# EAGLE schematic SDA390V1 (EAGLE 9.6.2)
Assembly variants: 75W
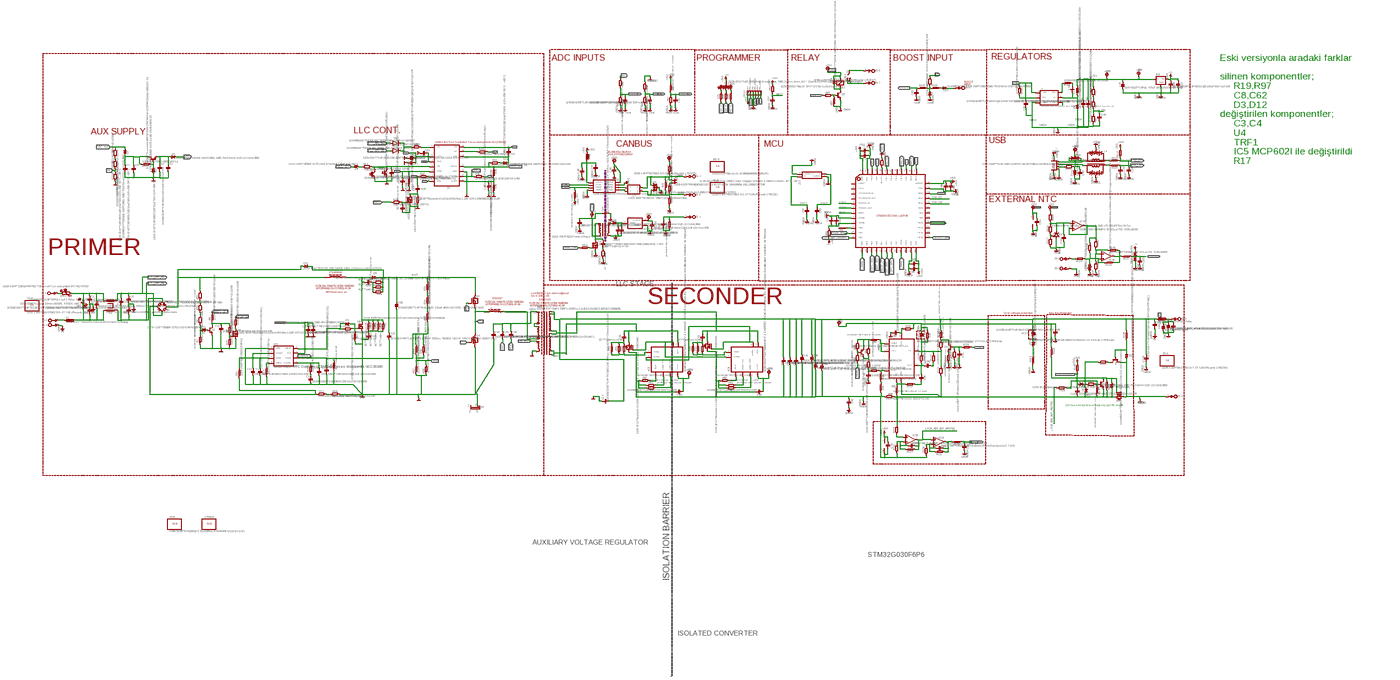
[diagram p0: schematic, sheet 1, overview]
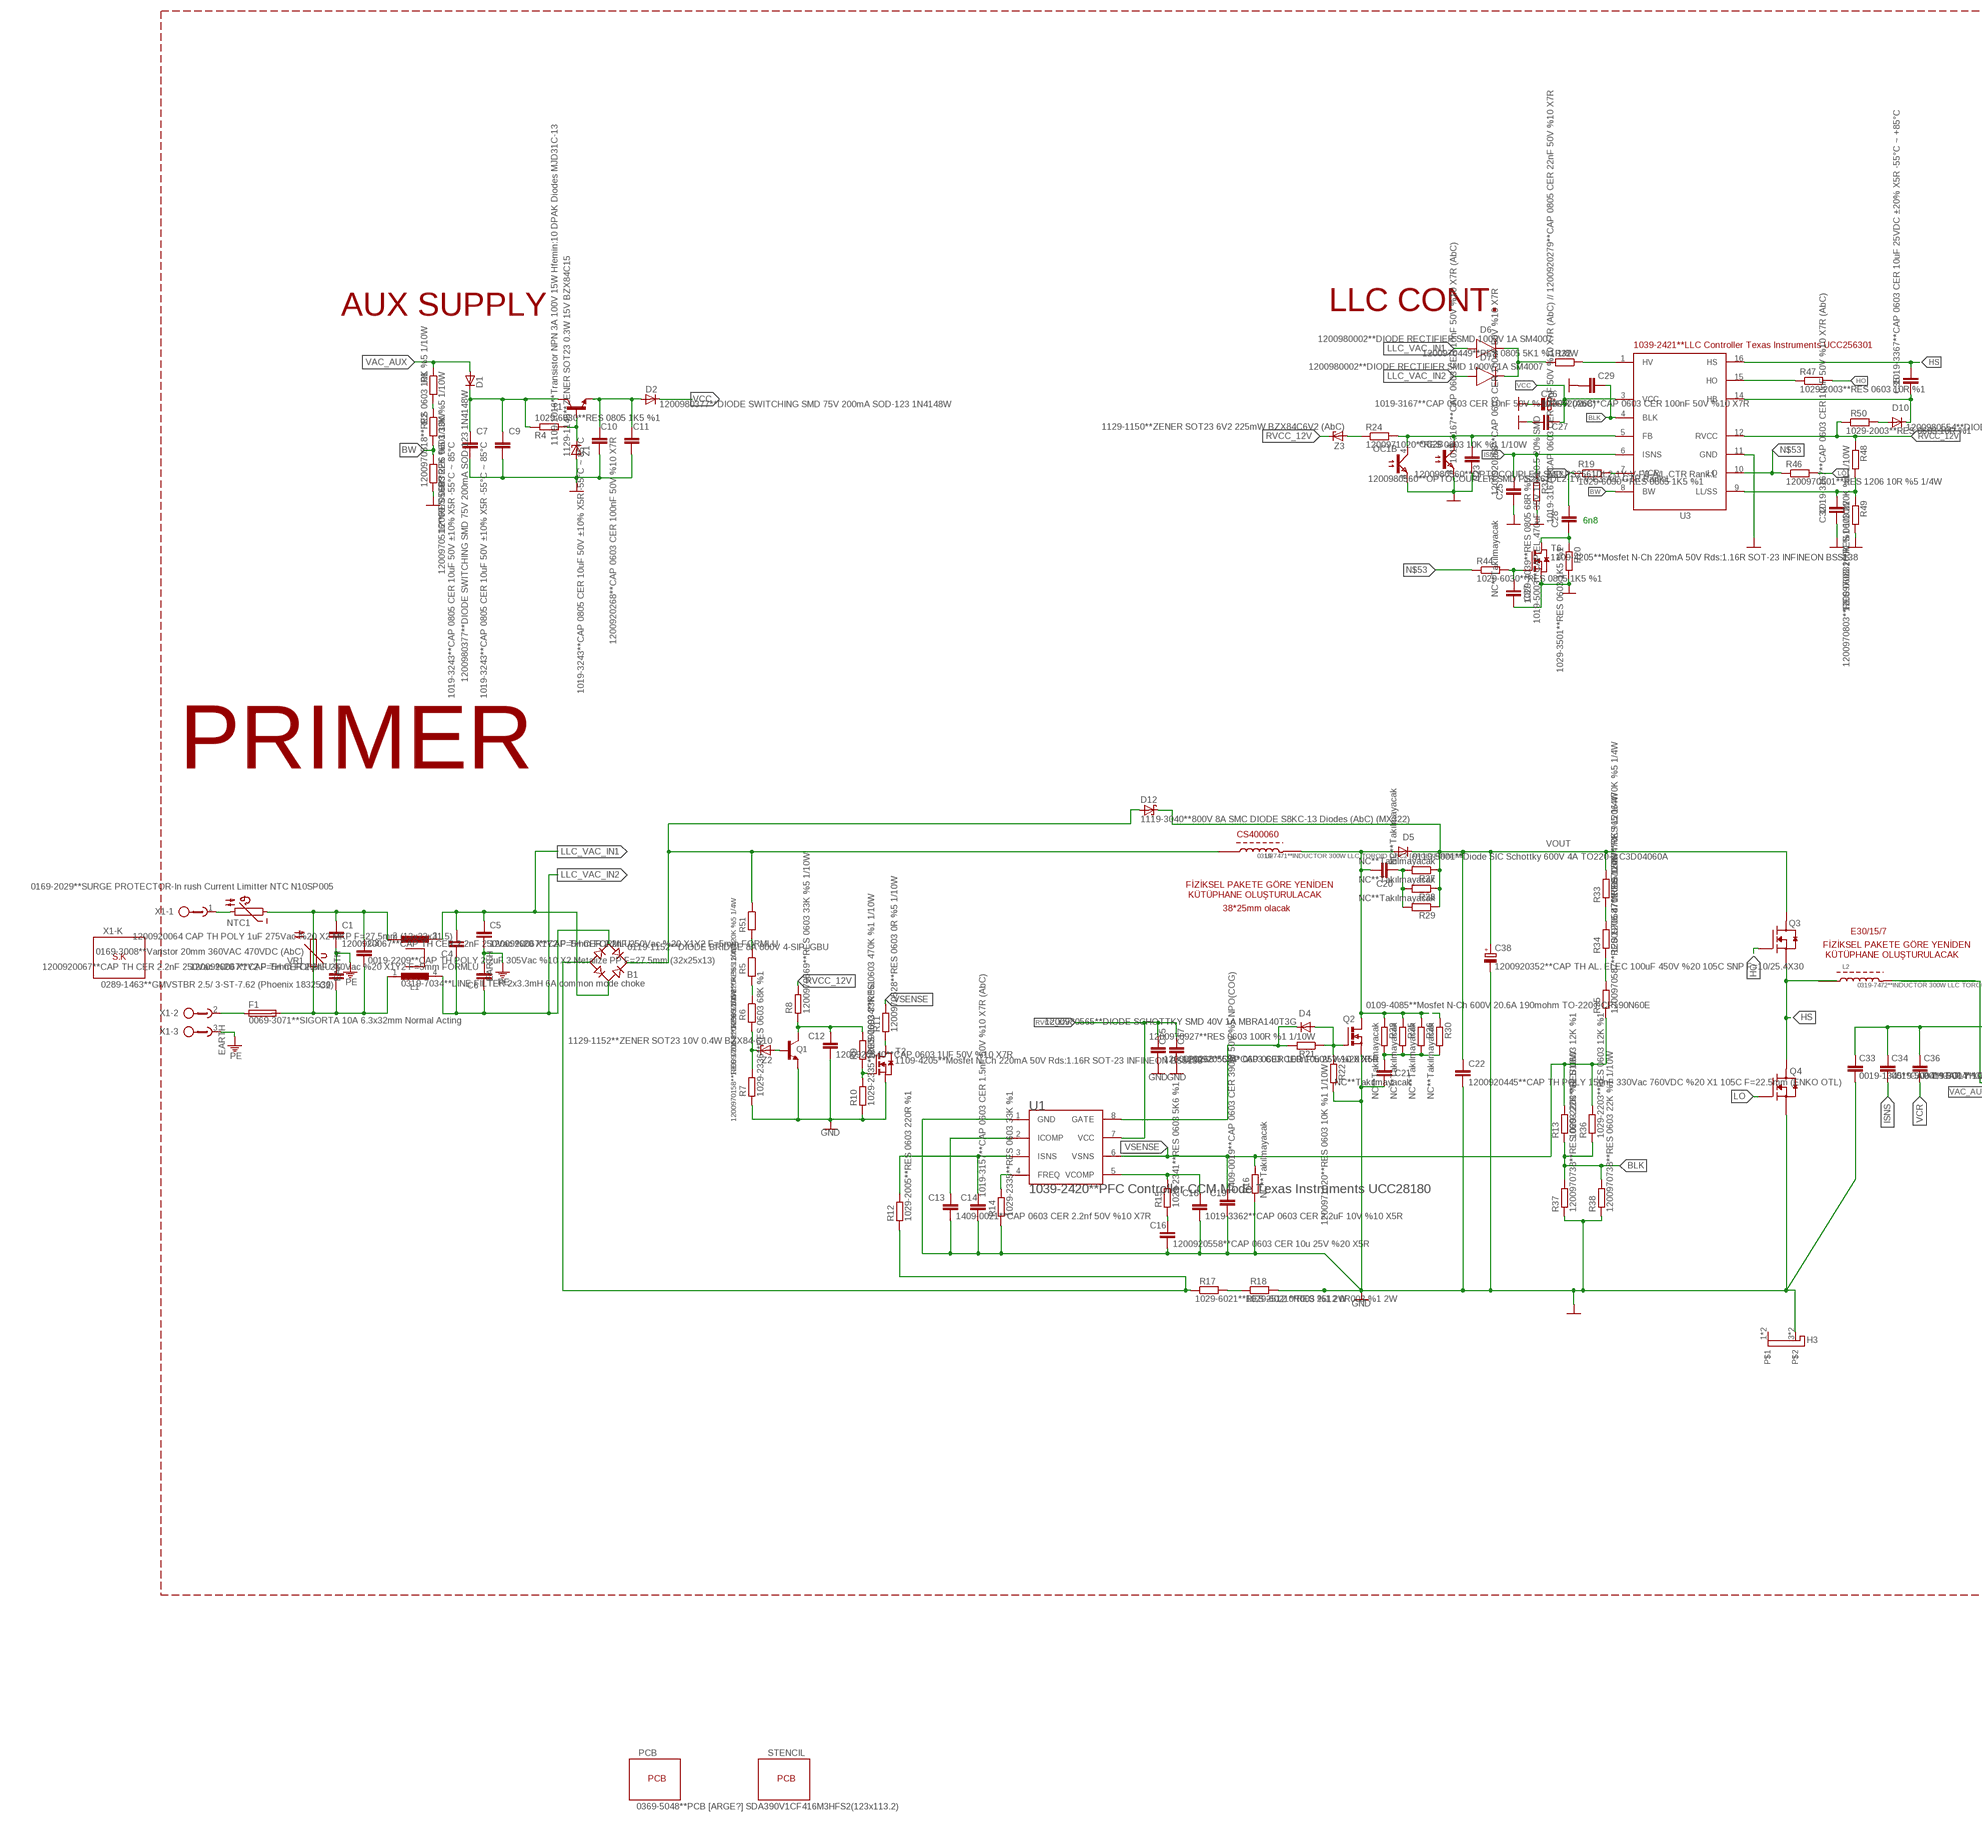
[diagram p1: schematic, sheet 1, part 1 of 6]
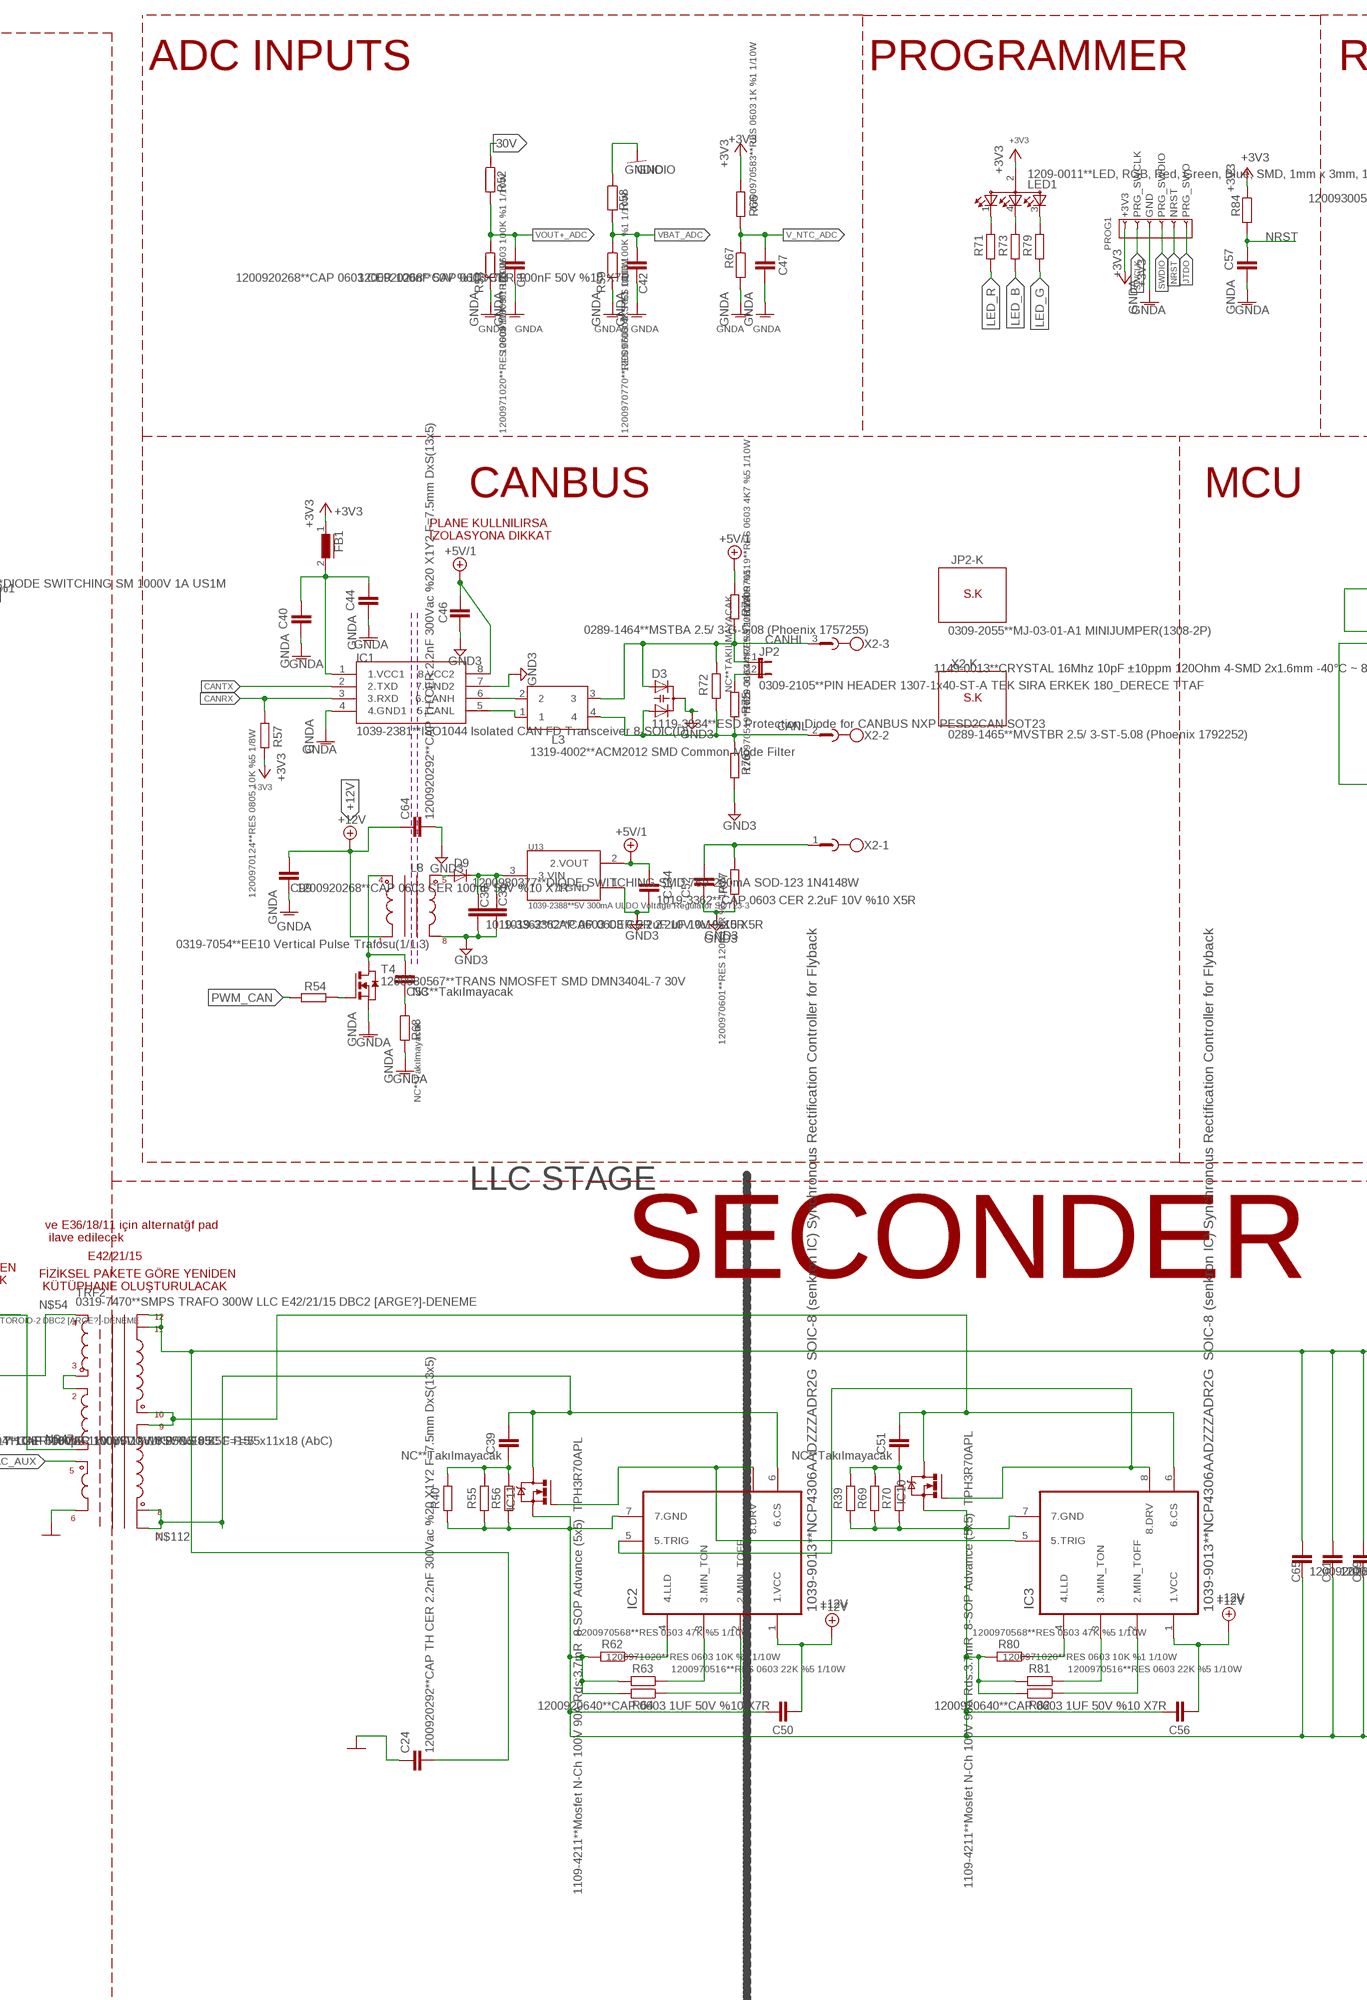
[diagram p2: schematic, sheet 1, part 2 of 6]
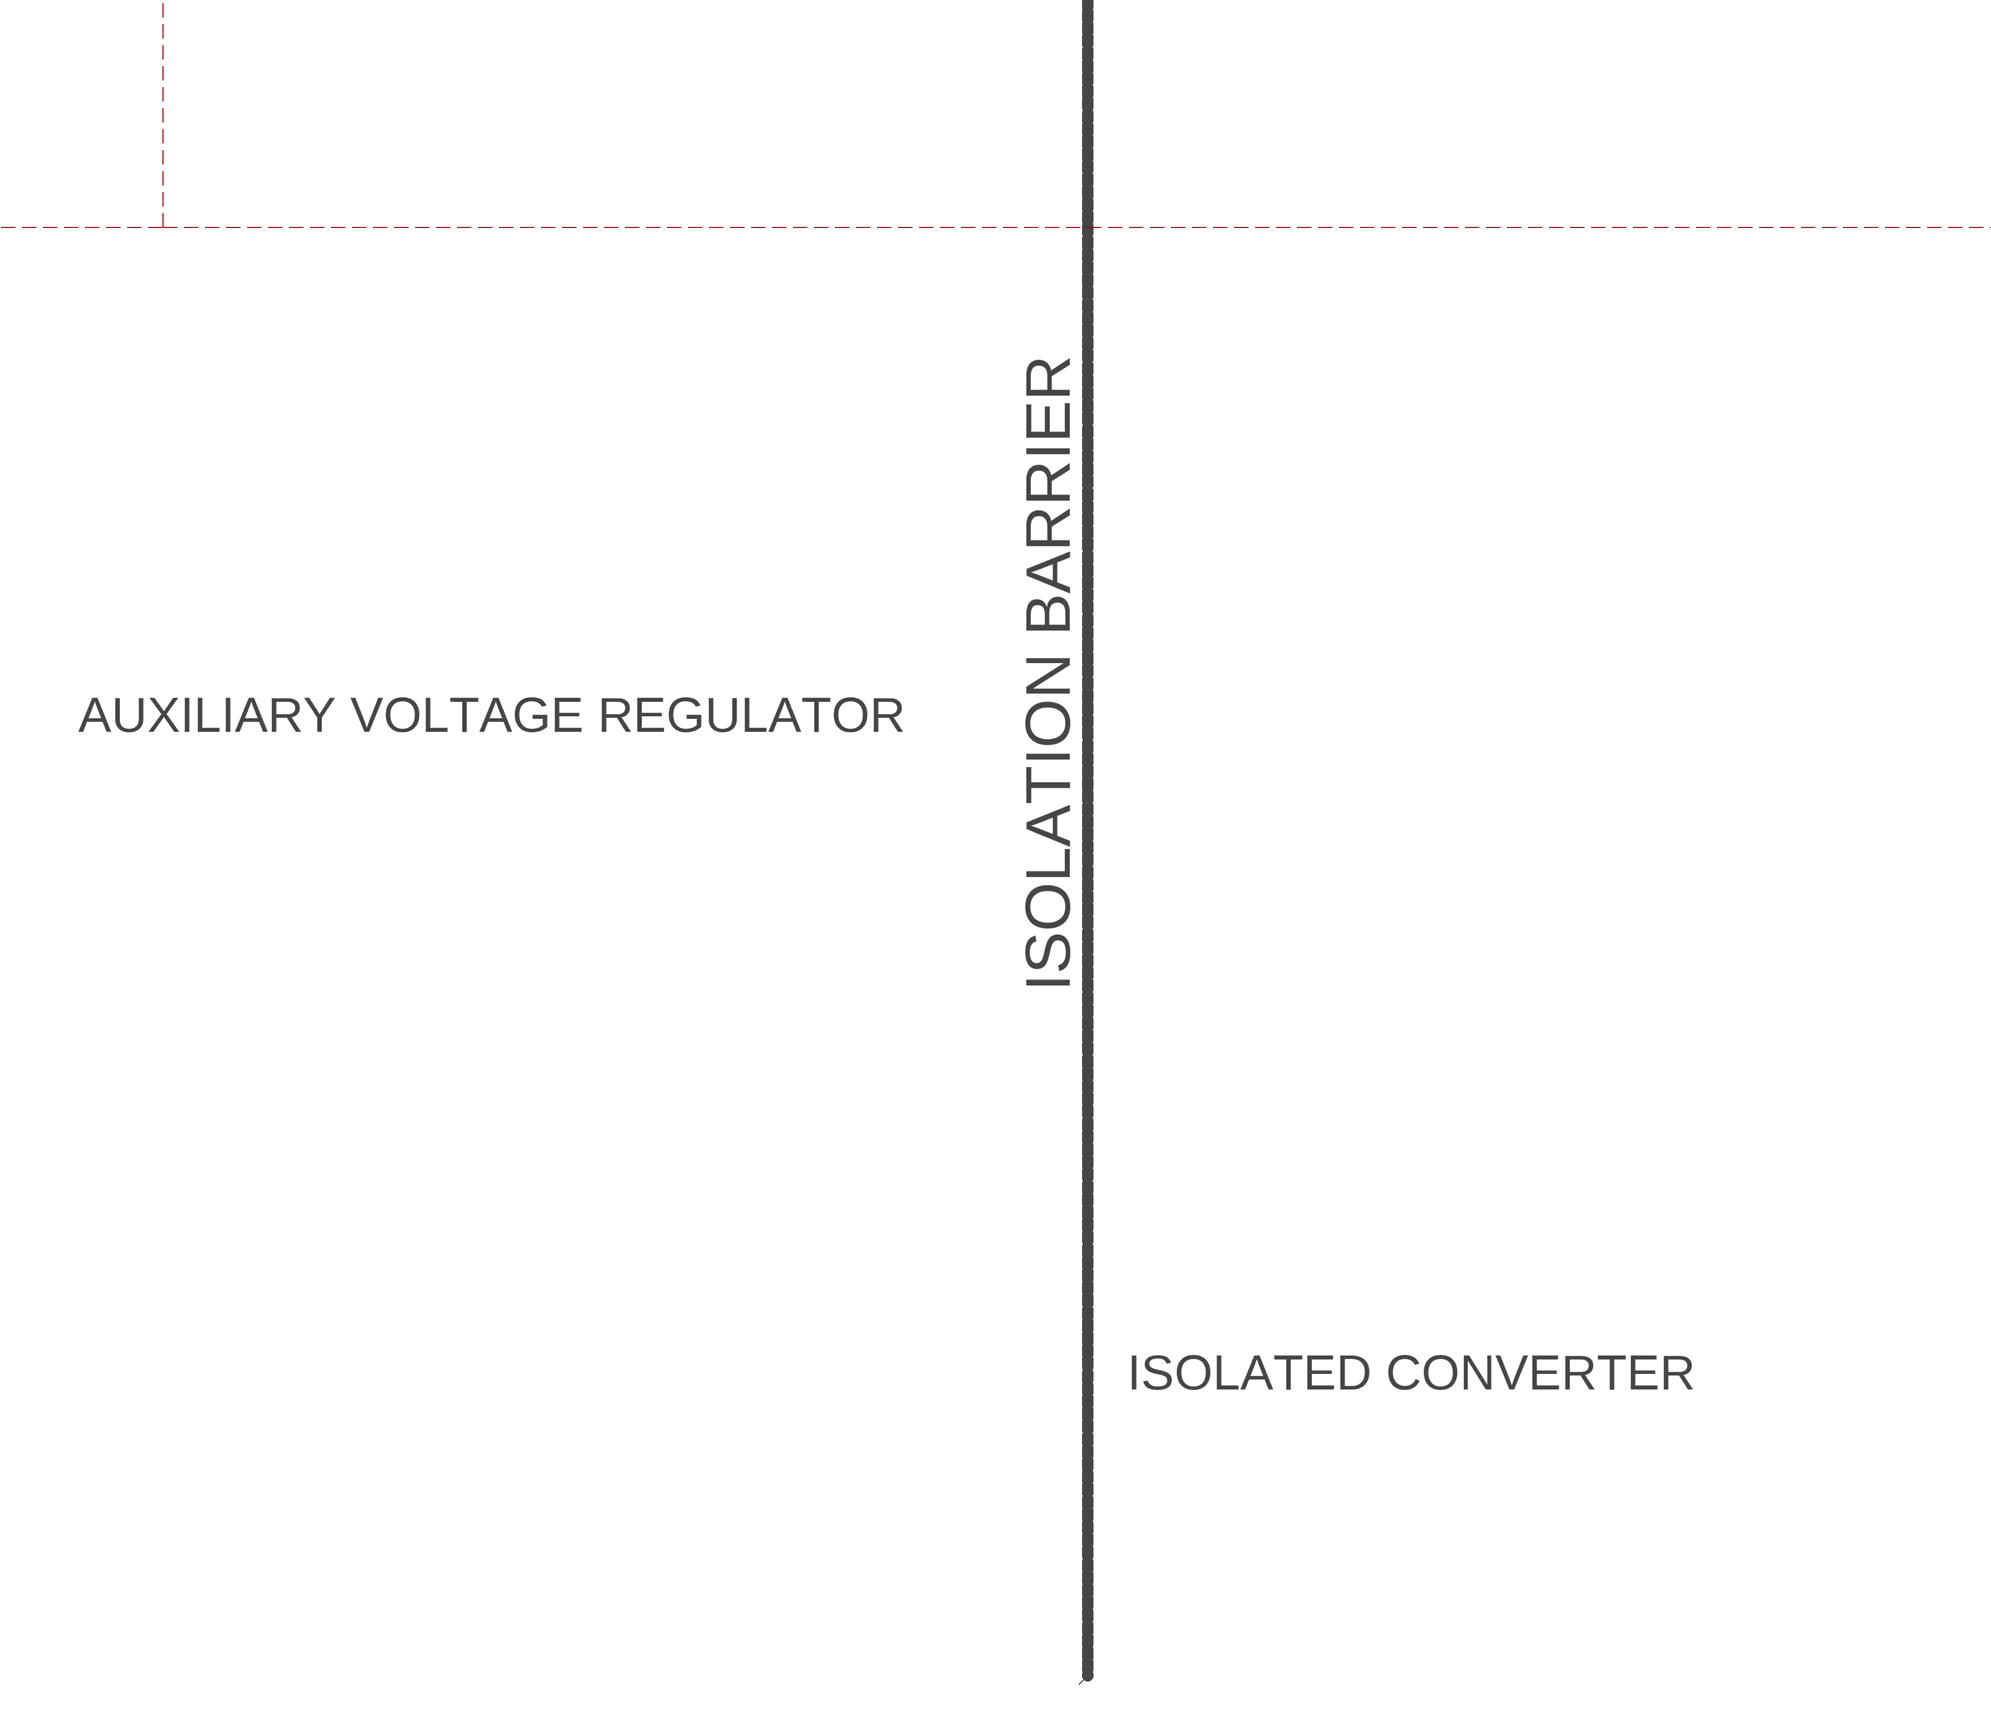
[diagram p3: schematic, sheet 1, part 3 of 6]
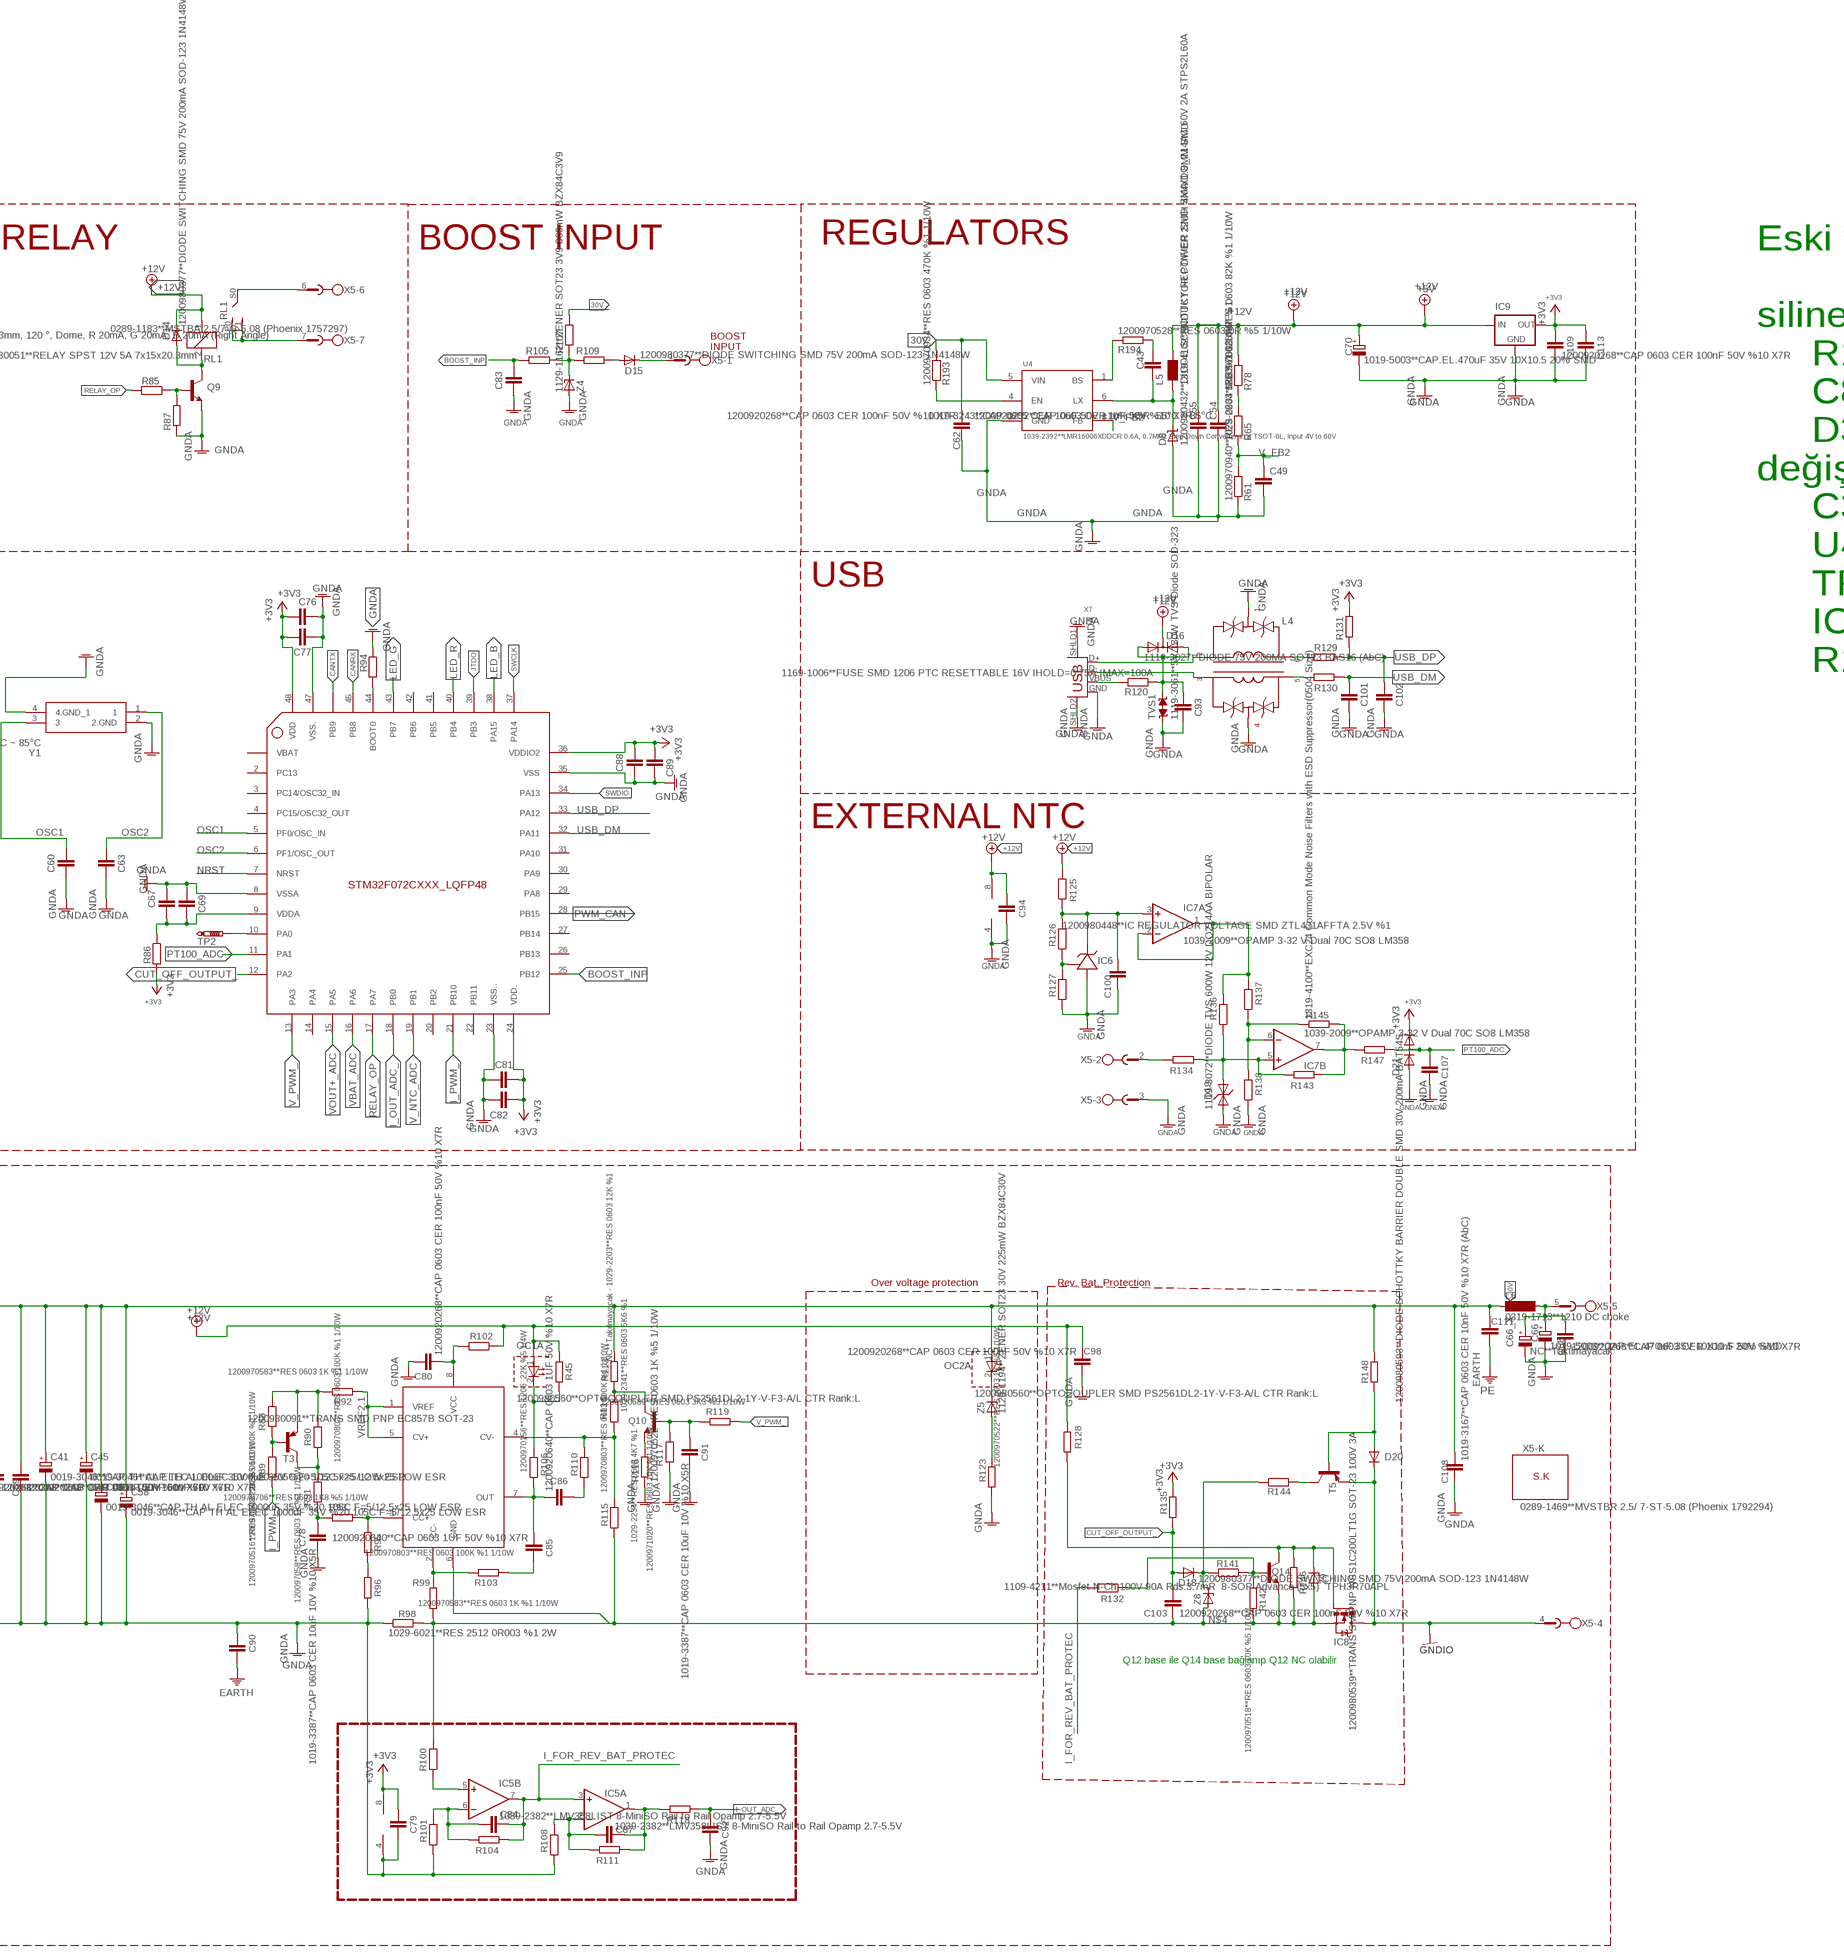
[diagram p4: schematic, sheet 1, part 4 of 6]
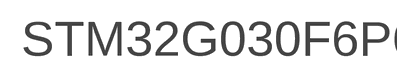
[diagram p5: schematic, sheet 1, part 5 of 6]
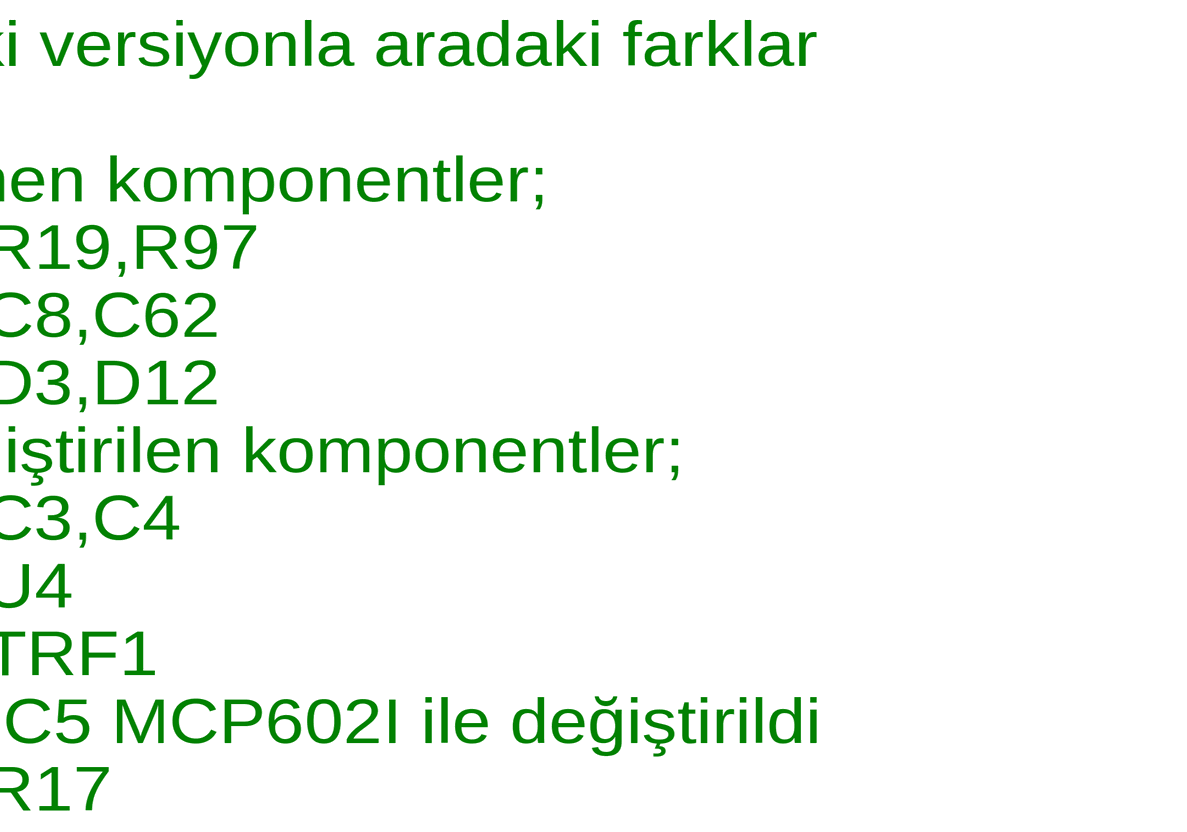
[diagram p6: schematic, sheet 1, part 6 of 6]

## Parts
B1  0119-1152**DIODE BRIDGE 8A 800V 4-SIP, GBU  DıODE_BRIDGE_8A_DIK  [DıODE_BRIDGE_8A_DIK]
C1  1200920067**CAP TH CER 2.2nF 250Vac %20 X1Y2 F=5mm FORMLU  C-EU050-035X075  [C050-035X075]
C2  1200920067**CAP TH CER 2.2nF 250Vac %20 X1Y2 F=5mm FORMLU  C-EU050-035X075  [C050-035X075]
C3  0019-2209**CAP TH POLY 2.2uF 305Vac %10 X2 Metalize PP F=27.5mm (32x25x13)  C275-134X316  [C275-134X316]
C4  1200920064 CAP TH POLY 1uF 275Vac %20 X2 MKP F=27.5mm (13x23x31.5)  C275-134X316  [C275-134X316]
C5  1200920067**CAP TH CER 2.2nF 250Vac %20 X1Y2 F=5mm FORMLU  C-EU050-035X075  [C050-035X075]
C6  1200920067**CAP TH CER 2.2nF 250Vac %20 X1Y2 F=5mm FORMLU  C-EU050-035X075  [C050-035X075]
C7  1019-3243**CAP 0805 CER 10uF 50V ±10% X5R -55°C ~ 85°C  C-EUC0805E  [C0805_ENKO]
C8  1200920268**CAP 0603 CER 100nF 50V %10 X7R  C-EUC0603E  [C0603_ENKO]
C9  1019-3243**CAP 0805 CER 10uF 50V ±10% X5R -55°C ~ 85°C  C-EUC0603E  [C0603_ENKO]
C10  1019-3243**CAP 0805 CER 10uF 50V ±10% X5R -55°C ~ 85°C  C-EUC0805E  [C0805_ENKO]
C11  1200920268**CAP 0603 CER 100nF 50V %10 X7R  C-EUC0603E  [C0603_ENKO]
C12  1200920640**CAP 0603 1UF 50V %10 X7R  C-EUC0603E  [C0603_ENKO]
C13  1409-0021**CAP 0603 CER 2.2nf 50V %10 X7R  C-EUC0603E  [C0603_ENKO]
C14  1019-3157**CAP 0603 CER 1.5nF 50V %10 X7R (AbC)  C-EUC0603E  [C0603_ENKO]
C15  1200920268**CAP 0603 CER 100nF 50V %10 X7R  C-EUC0603E  [C0603_ENKO]
C16  1200920558**CAP 0603 CER 10u 25V %20 X5R  C-EUC0603E  [C0603_ENKO]
C17  1200920558**CAP 0603 CER 10u 25V %20 X5R  C-EUC0603E  [C0603_ENKO]
C18  1019-3362**CAP 0603 CER 2.2uF 10V %10 X5R  C-EUC0603E  [C0603_ENKO]
C19  1409-0019**CAP 0603 CER 390pf 50V %5 NPO(COG)  C-EUC0603E  [C0603_ENKO]
C20  NC**Takılmayacak  C-EU050-030X075  [C050-030X075]
C21  NC**Takılmayacak  C-EU050-030X075  [C050-030X075]
C22  1200920445**CAP TH POLY 150nF 330Vac 760VDC %20 X1 105C F=22.5mm (ENKO OTL)  C-EU150-072X183  [C150-072X183]
C23  1019-3167**CAP 0603 CER 10nF 50V %10 X7R (AbC)  C-EUC0603E  [C0603_ENKO]
C24  1200920292**CAP TH CER 2.2nF 300Vac %20 X1Y2 F=7.5mm DxS(13x5)  C075-32X103_DEIF  [C075-32X103_DEIF]
C25  1200920268**CAP 0603 CER 100nF 50V %10 X7R  C-EUC0603E  [C0603_ENKO]
C26  1019-5003**CAP.EL.470uF 35V 10X10.5 20% SMD  CPOL-EUE5-10.5  [E5-10,5]
C27  1200920268**CAP 0603 CER 100nF 50V %10 X7R  C-EUC0603E  [C0603_ENKO]
C28  1019-3167**CAP 0603 CER 10nF 50V %10 X7R (AbC) // 1200920279**CAP 0805 CER 22nF 50V %10 X7R  C-EUC0603E  [C0603_ENKO]
C29  1019-3167**CAP 0603 CER 10nF 50V %10 X7R (AbC)  C-EUC0603E  [C0603_ENKO]
C30  1019-3362**CAP 0603 CER 2.2uF 10V %10 X5R  C-EUC0603E  [C0603_ENKO]
C31  1019-3362**CAP 0603 CER 2.2uF 10V %10 X5R  C-EUC0603E  [C0603_ENKO]
C32  1019-3167**CAP 0603 CER 10nF 50V %10 X7R (AbC)  C-EUC0603E  [C0603_ENKO]
C33  0019-1345**CAP TH POLY 10nF 600VAC 1000VDC MKP %5 85C F=15/5x11x18 (AbC)  C-EU150-072X183  [C150-072X183]
C34  0019-5004**CAP TH CER 100pF 1kV Y5V %10 85C F=5  C-EU050-055X075  [C050-055X075]
C35  1019-3367**CAP 0603 CER 10uF 25VDC ±20% X5R -55°C ~ +85°C  C-EUC0603E  [C0603_ENKO]
C36  0019-5004**CAP TH CER 100pF 1kV Y5V %10 85C F=5  C-EU050-050X075  [C050-050X075]
C37  NC**Takılmayacak  C-EUC0603E  [C0603_ENKO]
C38  1200920352**CAP TH AL. ELEC 100uF 450V %20 105C SNP F=10/25.4X30  CPOL-EUE10-25  [EB25D]
C39  NC**Takılmayacak  C-EUC1206E  [C1206_ENKO]
C40  1200920253**CAP 0603 CER 10n 50V%10 X7R  C-EUC0603E  [C0603_ENKO]
C41  0019-3046**CAP TH AL ELEC 1000uF 35V %20 105C F=5/12.5x25 LOW ESR  CPOL-EUE5-13  [E5-13]
C42  1200920268**CAP 0603 CER 100nF 50V %10 X7R  C-EUC0603E  [C0603_ENKO]
C43  1200920268**CAP 0603 CER 100nF 50V %10 X7R  C-EUC0603E  [C0603_ENKO]
C44  1200920268**CAP 0603 CER 100nF 50V %10 X7R  C-EUC0603E  [C0603_ENKO]
C45  0019-3046**CAP TH AL ELEC 1000uF 35V %20 105C F=5/12.5x25 LOW ESR  CPOL-EUE5-13  [E5-13]
C46  1200920268**CAP 0603 CER 100nF 50V %10 X7R  C-EUC0603E  [C0603_ENKO]
C47  1200920268**CAP 0603 CER 100nF 50V %10 X7R  C-EUC0603E  [C0603_ENKO]
C48  0019-3046**CAP TH AL ELEC 1000uF 35V %20 105C F=5/12.5x25 LOW ESR  CPOL-EUE5-13  [E5-13]
C49  1200920271**CAP 0603 CER 10pF 50V%10 COG  C-EUC0603E  [C0603_ENKO]
C50  1200920640**CAP 0603 1UF 50V %10 X7R  C-EUC0603E  [C0603_ENKO]
C51  NC**Takılmayacak  C-EUC1206E  [C1206_ENKO]
C52  1200920253**CAP 0603 CER 10n 50V%10 X7R  C-EUC0603E  [C0603_ENKO]
C53  NC**Takılmayacak  C-EUC0603E  [C0603_ENKO]
C54  1019-3243**CAP 0805 CER 10uF 50V ±10% X5R -55°C ~ 85°C  C-EUC0805E  [C0805_ENKO]
C55  1200920252**CAP 0603 CER 1nF 50V %10 X7R  C-EUC0603E  [C0603_ENKO]
C56  1200920640**CAP 0603 1UF 50V %10 X7R  C-EUC0603E  [C0603_ENKO]
C57  1200920268**CAP 0603 CER 100nF 50V %10 X7R  C-EUC0603E  [C0603_ENKO]
C58  0019-3046**CAP TH AL ELEC 1000uF 35V %20 105C F=5/12.5x25 LOW ESR  CPOL-EUE5-13  [E5-13]
C59  1200920268**CAP 0603 CER 100nF 50V %10 X7R  C-EUC0603E  [C0603_ENKO]
C60  1019-3352**CAP 0603 CER 22pF 50V %5 NPO  C-EUC0603E  [C0603_ENKO]
C61  1200920268**CAP 0603 CER 100nF 50V %10 X7R  C-EUC0603E  [C0603_ENKO]
C62  1200920268**CAP 0603 CER 100nF 50V %10 X7R  C-EUC0603E  [C0603_ENKO]
C63  1019-3352**CAP 0603 CER 22pF 50V %5 NPO  C-EUC0603E  [C0603_ENKO]
C64  1200920292**CAP TH CER 2.2nF 300Vac %20 X1Y2 F=7.5mm DxS(13x5)  C075-32X103_DEIF  [C075-32X103_DEIF]
C65  1200920268**CAP 0603 CER 100nF 50V %10 X7R  C-EUC0603E  [C0603_ENKO]
C66  1019-5003**CAP.EL.470uF 35V 10X10.5 20% SMD  CPOL-EUE5-10.5  [E5-10,5]
C66_X  NC**Takılmayacak  CPOL-EUE2.5-7  [E2,5-7]
C67  1200920268**CAP 0603 CER 100nF 50V %10 X7R  C-EUC0603E  [C0603_ENKO]
C68  1200920268**CAP 0603 CER 100nF 50V %10 X7R  C-EUC0603E  [C0603_ENKO]
C69  1019-3167**CAP 0603 CER 10nF 50V %10 X7R (AbC)  C-EUC0603E  [C0603_ENKO]
C70  1019-5003**CAP.EL.470uF 35V 10X10.5 20% SMD  CPOL-EUE5-10.5  [E5-10,5]
C76  1200920268**CAP 0603 CER 100nF 50V %10 X7R  C-EUC0603E  [C0603_ENKO]
C77  1019-3167**CAP 0603 CER 10nF 50V %10 X7R (AbC)  C-EUC0603E  [C0603_ENKO]
C78  1019-3387**CAP 0603 CER 10uF 10V %10 X5R  C-EUC0603E  [C0603_ENKO]
C79  1200920268**CAP 0603 CER 100nF 50V %10 X7R  C-EUC0603E  [C0603_ENKO]
C80  1200920268**CAP 0603 CER 100nF 50V %10 X7R  C-EUC0603E  [C0603_ENKO]
C81  1019-3167**CAP 0603 CER 10nF 50V %10 X7R (AbC)  C-EUC0603E  [C0603_ENKO]
C82  1200920268**CAP 0603 CER 100nF 50V %10 X7R  C-EUC0603E  [C0603_ENKO]
C83  1019-3167**CAP 0603 CER 10nF 50V %10 X7R (AbC)  C-EUC0603E  [C0603_ENKO]
C84  NC**TAKILMAYACAK (Not Fitted)  C-EUC0603E  [C0603_ENKO]
C85  1200920640**CAP 0603 1UF 50V %10 X7R  C-EUC0603E  [C0603_ENKO]
C86  1200920640**CAP 0603 1UF 50V %10 X7R  C-EUC0603E  [C0603_ENKO]
C87  1200920371**CAP 0603 CER 150p 50V%5 COG  C-EUC0603E  [C0603_ENKO]
C88  1019-3167**CAP 0603 CER 10nF 50V %10 X7R (AbC)  C-EUC0603E  [C0603_ENKO]
C89  1200920268**CAP 0603 CER 100nF 50V %10 X7R  C-EUC0603E  [C0603_ENKO]
C90  NC**TAKILMAYACAK (Not Fitted)  C-EU050-035X075  [C050-035X075]
C91  1019-3387**CAP 0603 CER 10uF 10V %10 X5R  C-EUC0603E  [C0603_ENKO]
C92  1200920268**CAP 0603 CER 100nF 50V %10 X7R  C-EUC0603E  [C0603_ENKO]
C93  1200920268**CAP 0603 CER 100nF 50V %10 X7R  C-EUC0603E  [C0603_ENKO]
C94  1200920268**CAP 0603 CER 100nF 50V %10 X7R  C-EUC0603E  [C0603_ENKO]
C98  1200920268**CAP 0603 CER 100nF 50V %10 X7R  C-EUC0603E  [C0603_ENKO]
C99  1200920268**CAP 0603 CER 100nF 50V %10 X7R  C-EUC0603E  [C0603_ENKO]
C100  1200920268**CAP 0603 CER 100nF 50V %10 X7R  C-EUC0603E  [C0603_ENKO]
C101  1019-3381**CAP 0603 CER 33pf 50V %5 NPO(COG)  C-EUC0603E  [C0603_ENKO]
C102  1019-3381**CAP 0603 CER 33pf 50V %5 NPO(COG)  C-EUC0603E  [C0603_ENKO]
C103  1200920268**CAP 0603 CER 100nF 50V %10 X7R  C-EUC0603E  [C0603_ENKO]
C107  1200920268**CAP 0603 CER 100nF 50V %10 X7R  C-EUC0603E  [C0603_ENKO]
C108  1019-3167**CAP 0603 CER 10nF 50V %10 X7R (AbC)  C-EUC0603E  [C0603_ENKO]
C109  1200920268**CAP 0603 CER 100nF 50V %10 X7R  C-EUC0603E  [C0603_ENKO]
C111  0019-1391**CAP TH CER 4700pF 250VAC 2.5kVDC X1Y2 %20 85C F=5mm  C-EU050-035X075  [C050-035X075]
C113  1019-3375**CAP 0603 CER 22uF 10V %20 X5R  C-EUC0603E  [C0603_ENKO]
C134  1019-3362**CAP 0603 CER 2.2uF 10V %10 X5R  C-EUC0603E  [C0603_ENKO]
D1  1200980377**DIODE SWITCHING SMD 75V 200mA SOD-123 1N4148W  DIODE-SOD123  [SOD123]
D2  1200980377**DIODE SWITCHING SMD 75V 200mA SOD-123 1N4148W  DIODE-SOD123  [SOD123]
D3  1119-3034**ESD Protection Diode for CANBUS NXP PESD2CAN SOT23  DIODE-2CAPACITANCESOT23  [SOT23]
D4  1200980565**DIODE SCHOTTKY SMD 40V 1A MBRA140T3G  DIODE-SOD106-R  [SOD106-R]
D5  0119-5001**Diode SIC Schottky 600V 4A TO220-2 C3D04060A  DIODE_12A_1000V_TO220  [DIODE_12A_1000V_TO220]
D6  1200980002**DIODE RECTIFIER SMD 1000V 1A SM4007  DIODE_DO-213AB(5025-METRIC)  [DIOMELF5024]
D7  1200980002**DIODE RECTIFIER SMD 1000V 1A SM4007  DIODE_DO-213AB(5025-METRIC)  [DIOMELF5024]
D8  1200980432**DIODE SCHOTTKY RECTIFIER SMD SMA/DO_214AC 60V 2A STPS2L60A  SD-SMA  [SMA]
D9  1200980377**DIODE SWITCHING SMD 75V 200mA SOD-123 1N4148W  DIODE-SOD123  [SOD123]
D10  1200980554**DIODE SWITCHING SM 1000V 1A US1M  DIODE-SOD106-R  [SOD106-R]
D12  1119-3040**800V 8A SMC DIODE S8KC-13 Diodes (AbC) (MX322)  SCHOTTKY-DIODESMC  [SMC]
D14  1200980377**DIODE SWITCHING SMD 75V 200mA SOD-123 1N4148W  DIODE-SOD123  [SOD123]
D15  1200980377**DIODE SWITCHING SMD 75V 200mA SOD-123 1N4148W  DIODE-SOD123  [SOD123]
D16  1119-3027**DIODE 75V 200MA SOT23 BAS16 (AbC)  DIODE-2AC|CASOT23  [SOT23]
D18  1200980377**DIODE SWITCHING SMD 75V 200mA SOD-123 1N4148W  DIODE-SOD123  [SOD123]
D19  1119-3072**DIODE TVS 600W 12V DO214AA BIPOLAR  TRANSIL_SMB  [TRANSIL_SMB]
D20  1200980377**DIODE SWITCHING SMD 75V 200mA SOD-123 1N4148W  DIODE-SOD123  [SOD123]
D21  1200980593**DIODE SCHOTTKY BARRIER DOUBLE SMD 30V 200mA BAT54S  BAV199  [SOT23]
F1  0069-3071**SIGORTA 10A 6.3x32mm Normal Acting  19560  [19560]
FB1  1319-4060**Ferrite Bead SMD 0805 2kOhm@100MHz 300mA LAIRD HZ0805C202R-10  FERRITE_BEAT_0805  [FERRITE_BEAT_0805]
H3  DEIF_SOGUTUCU_300W  [DEIF_SOGUTUCU_300W]
IC1  1039-2381**ISO1044 Isolated CAN FD Transceiver 8-SOIC(D)  ISO1044  [ISO1044]
IC2  1039-9013**NCP4306AADZZZADR2G SOIC-8 (senkron IC) Synchronous Rectification Controller for Flyback  NCP4306  [NCP4306]
IC3  1039-9013**NCP4306AADZZZADR2G SOIC-8 (senkron IC) Synchronous Rectification Controller for Flyback  NCP4306  [NCP4306]
IC4  1039-2224**TSM1011ID SO-8 Constant Voltage and Constant Current Controller  TSM1011  [SO-8]
IC5  1039-2382**LMV358LIST 8-MiniSO Rail to Rail Opamp 2.7-5.5V  LMV358M  [SO08]
IC6  1200980448**IC REGULATOR VOLTAGE SMD ZTL431AFFTA 2.5V %1  TL431_SOT23F  [TL431_SOT23F]
IC7  1039-2009**OPAMP 3-32 V Dual 70C SO8 LM358  LM358D  [SO08]
IC8  1109-4211**Mosfet N-Ch 100V 90A Rds:3.7mR 8-SOP Advance (5x5) TPH3R70APL  TPH6R30ANL  [TPH6R30ANL]
IC9  1039-3003**Voltage Regulator SOT-89 3.3V Diodes AP2204RA-3.3TRG1  S-812XSGUP  [SOT89]
IC10  1109-4211**Mosfet N-Ch 100V 90A Rds:3.7mR 8-SOP Advance (5x5) TPH3R70APL  TPH6R30ANL  [TPH6R30ANL]
IC11  1109-4211**Mosfet N-Ch 100V 90A Rds:3.7mR 8-SOP Advance (5x5) TPH3R70APL  TPH6R30ANL  [TPH6R30ANL]
JP2  0309-2105**PIN HEADER 1307-1x40-ST-A TEK SIRA ERKEK 180_DERECE TTAF  JP1E  [JP1]
JP2-K  0309-2055**MJ-03-01-A1 MINIJUMPER(1308-2P)  SOKET  [SOKET]
L1  0319-7034**LINE FILTER 2x3.3mH 6A common mode choke  EPCOS_B82724J  [EPCOS_B82724J]
L2  0319-7472**INDUCTOR 300W LLC TOROID-2 DBC2 [ARGE?]-DENEME  E25/13/7  [E25/13/7]
L3  1319-4002**ACM2012 SMD Common Mode Filter  ACM2012-900--2P-T002  [ACM2012-900--2P-T002]
L4  1319-4100**EXC24 Common Mode Noise Filters with ESD Suppressor(0504 Size)  EXC24CS_COMMON_MODE  [EXC24CS_COMMON_MODE]
L5  1319-4102**INDUCTOR POWER 22UH 4X4X1.8MM SMD  WE-PD2WE_PD2_5MM  [WE-PD2_5MM]
L6  0319-1713**1210 DC choke  INDUCTOR-NEOSID  [INDUCTOR-NEOSID]
L8  0319-7054**EE10 Vertical Pulse Trafosu(1/1.3)  EE10_V_4+4  [EE10_V_4+4]
LED1  1209-0011**LED, RGB, Red, Green, Blue, SMD, 1mm x 3mm, 120 °, Dome, R 20mA, G 20mA, B 20mA (Right Angle)  KPFA-3010RGBC-11  [KPFA-3010RGBC-11]
NTC1  0169-2029**SURGE PROTECTOR-In rush Current Limitter NTC N10SP005  SENS_NTC  [SENS_NTC]
OC1  1200980560**OPTOCOUPLER SMD PS2561DL2-1Y-V-F3-A/L CTR Rank:L  PS2561DL2-1_OPTO1  [PS2561DL2-1_OPTO1]
OC2  1200980560**OPTOCOUPLER SMD PS2561DL2-1Y-V-F3-A/L CTR Rank:L  PS2561DL2-1_OPTO1  [PS2561DL2-1_OPTO1]
PCB  0369-5048**PCB [ARGE?] SDA390V1CF416M3HFS2(123x113.2)  PCB  [PCB]
PROG1  NC**TAKILMAYACAK  PROG_6PIN  [PROG_6PIN]
Q1  1200980090**TRANS SMD NPN BC847B SOT-23  BC846ALT1SMD  [SOT23]
Q2  0109-4085**Mosfet N-Ch 600V 20.6A 190mohm TO-220 FCP190N60E  PMOSFET_NTO220BV  [TO220BV]
Q3  0109-4088**Mosfet N-Ch 10.2A 650V Rds:380mR TO-220F Fairchild FCPF380N65FL1  ISO_TO_220  [ISO_TO_220]
Q4  0109-4088**Mosfet N-Ch 10.2A 650V Rds:380mR TO-220F Fairchild FCPF380N65FL1  ISO_TO_220  [ISO_TO_220]
Q9  1200980090**TRANS SMD NPN BC847B SOT-23  BC846ALT1SMD  [SOT23]
Q10  1200980090**TRANS SMD NPN BC847B SOT-23  BC846BLT1SMD  [SOT23]
Q14  1200980090**TRANS SMD NPN BC847B SOT-23  BC846ALT1SMD  [SOT23]
R1  1200970569**RES 0603 33K %5 1/10W  R-EU_R0603E  [R0603_ENKO]
R2  1200970516**RES 0603 22K %5 1/10W  R-EU_R0603E  [R0603_ENKO]
R3  1200970518**RES 0603 10K %5 1/10W  R-EU_R0603E  [R0603_ENKO]
R4  1029-6030**RES 0805 1K5 %1  R-EU_R0805E  [R0805_ENKO]
R5  1200970158**RES 1206 220K %5 1/4W  R-EU_R1206  [R1206]
R6  1200970158**RES 1206 220K %5 1/4W  R-EU_R1206  [R1206]
R7  1029-2336**RES 0603 68K %1  R-EU_R0603E  [R0603_ENKO]
R8  1200970569**RES 0603 33K %5 1/10W  R-EU_R0603E  [R0603_ENKO]
R9  1200970934**RES 0603 470K %1 1/10W  R-EU_R0603E  [R0603_ENKO]
R10  1029-2335**RES 0603 33K %1  R-EU_R0603E  [R0603_ENKO]
R11  1200970528**RES 0603 0R %5 1/10W  R-EU_R0603E  [R0603_ENKO]
R12  1029-2005**RES 0603 220R %1  R-EU_R0603E  [R0603_ENKO]
R13  1029-2203**RES 0603 12K %1  R-EU_R0603E  [R0603_ENKO]
R14  1029-2335**RES 0603 33K %1  R-EU_R0603E  [R0603_ENKO]
R15  1029-2341**RES 0603 5K6 %1  R-EU_R0603E  [R0603_ENKO]
R16  NC**Takılmayacak  R-EU_R0603E  [R0603_ENKO]
R17  1029-6021**RES 2512 0R003 %1 2W  R-EU_R2512  [R2512]
R18  1029-6021**RES 2512 0R003 %1 2W  R-EU_R2512  [R2512]
R19  1029-6030**RES 0805 1K5 %1  R-EU_R0805E  [R0805_ENKO]
R20  1029-3501**RES 0603 1K5 %1  R-EU_R0603E  [R0603_ENKO]
R21  1200970927**RES 0603 100R %1 1/10W  R-EU_R0603E  [R0603_ENKO]
R22  1200971020**RES 0603 10K %1 1/10W  R-EU_R0603E  [R0603_ENKO]
R23  NC**Takılmayacak  R-EU_R1206E  [R1206_ENKO]
R24  1200971020**RES 0603 10K %1 1/10W  R-EU_R0603E  [R0603_ENKO]
R25  NC**Takılmayacak  R-EU_R1206E  [R1206_ENKO]
R26  NC**Takılmayacak  R-EU_R1206E  [R1206_ENKO]
R27  NC**Takılmayacak  R-EU_R1206E  [R1206_ENKO]
R28  NC**Takılmayacak  R-EU_R1206E  [R1206_ENKO]
R29  NC**Takılmayacak  R-EU_R1206E  [R1206_ENKO]
R30  NC**Takılmayacak  R-EU_R1206E  [R1206_ENKO]
R31  1029-3039**RES 0805 68R %5  R-EU_R0603E  [R0603_ENKO]
R32  1200970449**RES 0805 5K1 %1 1/8W  R-EU_R0805E  [R0805_ENKO]
R33  1200970587**RES 1206 470K %5 1/4W  R-EU_R1206E  [R1206_ENKO]
R34  1200970587**RES 1206 470K %5 1/4W  R-EU_R1206E  [R1206_ENKO]
R35  1200970587**RES 1206 470K %5 1/4W  R-EU_R1206E  [R1206_ENKO]
R36  1029-2203**RES 0603 12K %1  R-EU_R0603E  [R0603_ENKO]
R37  1200970738**RES 0603 22K %1 1/10W  R-EU_R0603E  [R0603_ENKO]
R38  1200970738**RES 0603 22K %1 1/10W  R-EU_R0603E  [R0603_ENKO]
R39  NC**TAKILMAYACAK  R-EU_R1206E  [R1206_ENKO]
R40  NC**TAKILMAYACAK  R-EU_R1206E  [R1206_ENKO]
R44  1029-6030**RES 0805 1K5 %1  R-EU_R0805E  [R0805_ENKO]
R45  1409-0025**RES 0603 470R %5 1/16W  R-EU_R0603E  [R0603_ENKO]
R46  1200970601**RES 1206 10R %5 1/4W  R-EU_R1206E  [R1206_ENKO]
R47  1029-2003**RES 0603 10R %1  R-EU_R0603E  [R0603_ENKO]
R48  1200970832**RES 0603 220K %1 1/10W  R-EU_R0603E  [R0603_ENKO]
R49  1200970803**RES 0603 100K %1 1/10W  R-EU_R0603E  [R0603_ENKO]
R50  1029-2003**RES 0603 10R %1  R-EU_R0603E  [R0603_ENKO]
R51  1200970158**RES 1206 220K %5 1/4W  R-EU_R1206  [R1206]
R52  1200970803**RES 0603 100K %1 1/10W  R-EU_R0603E  [R0603_ENKO]
R53  1200971020**RES 0603 10K %1 1/10W  R-EU_R0603E  [R0603_ENKO]
R54  1029-2003**RES 0603 10R %1  R-EU_R0603E  [R0603_ENKO]
R55  NC**TAKILMAYACAK  R-EU_R1206E  [R1206_ENKO]
R56  NC**Takılmayacak  R-EU_R1206E  [R1206_ENKO]
R57  1200970124**RES 0805 10K %5 1/8W  R-EU_R0805E  [R0805_ENKO]
R58  1200970803**RES 0603 100K %1 1/10W  R-EU_R0603E  [R0603_ENKO]
R59  1200970770**RES 0603 4K3 %1 1/10W  R-EU_R0603E  [R0603_ENKO]
R61  1200970940**RES 0603 6K8 %1 1/10W  R-EU_R0603E  [R0603_ENKO]
R62  1200970568**RES 0603 47K %5 1/10W  R-EU_R0603E  [R0603_ENKO]
R63  1200971020**RES 0603 10K %1 1/10W  R-EU_R0603E  [R0603_ENKO]
R64  1200970516**RES 0603 22K %5 1/10W  R-EU_R0603E  [R0603_ENKO]
R65  1029-2234**RES 0603 4K7 %1  R-EU_R0603E  [R0603_ENKO]
R66  1200970583**RES 0603 1K %1 1/10W  R-EU_R0603E  [R0603_ENKO]
R67  1169-1001**TSM2A103F3951RZ THINKING 0805 10K NTC 125C  R-EU_R0805E  [R0805_ENKO]
R68  NC**Takılmayacak  R-EU_R0603E  [R0603_ENKO]
R69  NC**TAKILMAYACAK  R-EU_R1206E  [R1206_ENKO]
R70  NC**Takılmayacak  R-EU_R1206E  [R1206_ENKO]
R71  1029-2005**RES 0603 220R %1  R-EU_R0603E  [R0603_ENKO]
R72  NC**TAKILMAYACAK  R-EU_R1206E  [R1206_ENKO]
R73  1029-2005**RES 0603 220R %1  R-EU_R0603E  [R0603_ENKO]
R74  1200970519**RES 0603 4K7 %5 1/10W  R-EU_R0603E  [R0603_ENKO]
R75  1029-3164**RES 1206 120R %1  R-EU_R1206E  [R1206_ENKO]
R76  1200970519**RES 0603 4K7 %5 1/10W  R-EU_R0603E  [R0603_ENKO]
R77  1200970601**RES 1206 10R %5 1/4W  R-EU_R1206E  [R1206_ENKO]
R78  1200970626**RES 0603 82K %1 1/10W  R-EU_R0603E  [R0603_ENKO]
R79  1029-2005**RES 0603 220R %1  R-EU_R0603E  [R0603_ENKO]
R80  1200970568**RES 0603 47K %5 1/10W  R-EU_R0603E  [R0603_ENKO]
R81  1200971020**RES 0603 10K %1 1/10W  R-EU_R0603E  [R0603_ENKO]
R82  1200970516**RES 0603 22K %5 1/10W  R-EU_R0603E  [R0603_ENKO]
R84  1200970518**RES 0603 10K %5 1/10W  R-EU_R0603E  [R0603_ENKO]
R85  1200970522**RES 0603 1K %5 1/10W  R-EU_R0603E  [R0603_ENKO]
R86  1319-4060**Ferrite Bead SMD 0805 2kOhm@100MHz 300mA LAIRD HZ0805C202R-10  R-EU_R0805E  [R0805_ENKO]
R87  1200970518**RES 0603 10K %5 1/10W  R-EU_R0603E  [R0603_ENKO]
R88  1200970803**RES 0603 100K %1 1/10W  R-EU_R0603E  [R0603_ENKO]
R89  1200970516**RES 0603 22K %5 1/10W  R-EU_R0603E  [R0603_ENKO]
R90  1200970803**RES 0603 100K %1 1/10W  R-EU_R0603E  [R0603_ENKO]
R91  120097058**RES 0603 1K %1 1/10W  R-EU_R0603E  [R0603_ENKO]
R92  1200970583**RES 0603 1K %1 1/10W  R-EU_R0603E  [R0603_ENKO]
R93  1200970706**RES 0603 1K8 %5 1/10W  R-EU_R0603E  [R0603_ENKO]
R94  1200970522**RES 0603 1K %5 1/10W  R-EU_R0603E  [R0603_ENKO]
R95  1200970927**RES 0603 100R %1 1/10W  R-EU_R0603E  [R0603_ENKO]
R96  1200970528**RES 0603 0R %5 1/10W  R-EU_R0603E  [R0603_ENKO]
R98  1029-6021**RES 2512 0R003 %1 2W  R-EU_R2512  [R2512]
R99  1200970583**RES 0603 1K %1 1/10W  R-EU_R0603E  [R0603_ENKO]
R100  1200970522**RES 0603 1K %5 1/10W  R-EU_R0603E  [R0603_ENKO]
R101  1200970522**RES 0603 1K %5 1/10W  R-EU_R0603E  [R0603_ENKO]
R102  1029-2003**RES 0603 10R %1  R-EU_R0603E  [R0603_ENKO]
R103  1200970803**RES 0603 100K %1 1/10W  R-EU_R0603E  [R0603_ENKO]
R104  1029-2233**RES 0603 2K2 %1  R-EU_R0603E  [R0603_ENKO]
R105  1200970518**RES 0603 10K %5 1/10W  R-EU_R0603E  [R0603_ENKO]
R106  1200970156**RES 1206 22K %5 1/4W  R-EU_R1206E  [R1206_ENKO]
R107  1200970584**RES 0603 18K %1 1/10W  R-EU_R0603E  [R0603_ENKO]
R108  1200970583**RES 0603 1K %1 1/10W  R-EU_R0603E  [R0603_ENKO]
R109  1200970584**RES 0603 18K %1 1/10W  R-EU_R0603E  [R0603_ENKO]
R110  1200970803**RES 0603 100K %1 1/10W  R-EU_R0603E  [R0603_ENKO]
R111  1029-6089**RES 0603 6K8 %5  R-EU_R0603E  [R0603_ENKO]
R113  NC**Takılmayacak - 1029-2203**RES 0603 12K %1  R-EU_R0603E  [R0603_ENKO]
R114  1029-2341**RES 0603 5K6 %1  R-EU_R0603E  [R0603_ENKO]
R115  1029-2234**RES 0603 4K7 %1  R-EU_R0603E  [R0603_ENKO]
R116  1200970522**RES 0603 1K %5 1/10W  R-EU_R0603E  [R0603_ENKO]
R117  1200971020**RES 0603 10K %1 1/10W  R-EU_R0603E  [R0603_ENKO]
R118  1200970522**RES 0603 1K %5 1/10W  R-EU_R0603E  [R0603_ENKO]
R119  1200970689**RES 0603 3K3 %5 1/10W  R-EU_R0603E  [R0603_ENKO]
R120  1169-1006**FUSE SMD 1206 PTC RESETTABLE 16V IHOLD=0.75A IMAX=100A  R-EU_R1206E  [R1206_ENKO]
R123  1200970522**RES 0603 1K %5 1/10W  R-EU_R0603E  [R0603_ENKO]
R125  1200970193**RES 0805 4K7 %5 1/8W  R-EU_R0805E  [R0805_ENKO]
R126  1029-2234**RES 0603 4K7 %1  R-EU_R0603E  [R0603_ENKO]
R127  1029-2234**RES 0603 4K7 %1  R-EU_R0603E  [R0603_ENKO]
R128  1200970515**RES 0603 100K %5 1/10W  R-EU_R0603E  [R0603_ENKO]
R129  1029-6086**RES 0603 22R %1  R-EU_R0603E  [R0603_ENKO]
R130  1029-6086**RES 0603 22R %1  R-EU_R0603E  [R0603_ENKO]
R131  1029-3501**RES 0603 1K5 %1  R-EU_R0603E  [R0603_ENKO]
R132  1200971020**RES 0603 10K %1 1/10W  R-EU_R0603E  [R0603_ENKO]
R134  1200970528**RES 0603 0R %5 1/10W  R-EU_R0603E  [R0603_ENKO]
R135  1200970516**RES 0603 22K %5 1/10W  R-EU_R0603E  [R0603_ENKO]
R136  1029-2234**RES 0603 4K7 %1  R-EU_R0603E  [R0603_ENKO]
R137  1200970684**RES 0603 47K %1 1/10W  R-EU_R0603E  [R0603_ENKO]
R138  1200970583**RES 0603 1K %1 1/10W  R-EU_R0603E  [R0603_ENKO]
R141  1200970522**RES 0603 1K %5 1/10W  R-EU_R0603E  [R0603_ENKO]
R142  1200970518**RES 0603 10K %5 1/10W  R-EU_R0603E  [R0603_ENKO]
R143  1029-2229**RES 0603 120K %1  R-EU_R0603E  [R0603_ENKO]
R144  1029-2337**RES 0603 39K %1  R-EU_R0603E  [R0603_ENKO]
R145  1200970687**RES 0603 56K %1 1/10W  R-EU_R0603E  [R0603_ENKO]
R146  1200970585**RES 0603 1M %5 1/10W  R-EU_R0603E  [R0603_ENKO]
R147  1200970730**RES 0603 560R %1 1/10W  R-EU_R0603E  [R0603_ENKO]
R148  1029-3066**RES 0805 56K %5  R-EU_R0805E  [R0805_ENKO]
R193  1200970934**RES 0603 470K %1 1/10W  R-EU_R0603E  [R0603_ENKO]
R194  1200970528**RES 0603 0R %5 1/10W  R-EU_R0603E  [R0603_ENKO]  (variant 75W: 1200970528**RES 0603 0R %5 1/10W )
RL1  1200930051**RELAY SPST 12V 5A 7x15x20.3mm  ALD1_AND_ALJ_RELAY  [ALD1_AND_ALJ_RELAY]
STENCIL  PCB  [PCB]
T1  1109-1016**Transistor NPN 3A 100V 15W Hfemin:10 DPAK Diodes MJD31C-13  MJD31C  [DPAK]
T2  1109-4205**Mosfet N-Ch 220mA 50V Rds:1.16R SOT-23 INFINEON BSS138  NMOSSOT23  [SOT-23]
T3  1200980091**TRANS SMD PNP BC857B SOT-23  BC856B-PNP-SOT23-BEC  [SOT23-BEC]
T4  1200980567**TRANS NMOSFET SMD DMN3404L-7 30V  NMOSSOT23  [SOT-23]
T5  1200980539**TRANS SM PNP NSS1C200LT1G SOT-23 100V 3A  BC856B-PNP-SOT23-BEC  [SOT23-BEC]
T6  1109-4205**Mosfet N-Ch 220mA 50V Rds:1.16R SOT-23 INFINEON BSS138  NMOSSOT23  [SOT-23]
TP2  PTR1TP20R  [TP20R]
TRF2  0319-7470**SMPS TRAFO 300W LLC E42/21/15 DBC2 [ARGE?]-DENEME  E34/14/9  [E34/14/9]
TVS1  1119-3061**5V 130W TVS Diode SOD-323  TVS-BD-SOD323  [SOD323]
U1  1039-2420**PFC Controller CCM Mode Texas Instruments UCC28180  UCC28180  [UCC28180]
U2  0319-7471**INDUCTOR 300W LLC TOROID DBC2 [ARGE?]-DENEME  IND_TOROID  [IND_TOROID]
U3  1039-2421**LLC Controller Texas Instruments UCC256301  UCC256301  [SOIC16_UCC256301]
U4  1039-2392**LMR16006XDDCR 0.6A, 0.7MHz Step-Down Converter in a TSOT-6L, Input 4V to 60V  AOZ1282CI-1  [AOZ1282CI-1]
U5  1039-2220**STM32F072C8T6 64K Flash USB, CAN  STM32F072CXXX_LQFP48  [STM32F072CXXX_LQFP48]
U13  1039-2388**5V 300mA ULDO Voltage Regulator SOT23-3  AP2210N-5.0TRG1_SOT23-3  [AP2210N-5.0TRG1_SOT23-3]
VR1  0169-3008**Varistor 20mm 360VAC 470VDC (AbC)  S20K40  [S20K40]
X1  0289-1462**GMSTBA 2.5/ 3-G-7.62 (Phoenix 1766246)  GMSTBA3  [GMSTBA3]
X1-K  0289-1463**GMVSTBR 2.5/ 3-ST-7.62 (Phoenix 1832536)  SOKET  [SOKET]
X2  0289-1464**MSTBA 2.5/ 3-G-5.08 (Phoenix 1757255)  MSTBA3  [MSTBA3]
X2-K  0289-1465**MVSTBR 2.5/ 3-ST-5.08 (Phoenix 1792252)  SOKET  [SOKET]
X5  0289-1183**MSTBA 2.5/7-G-5.08 (Phoenix 1757297)  MSTBA7  [MSTBA7]
X5-K  0289-1469**MVSTBR 2.5/ 7-ST-5.08 (Phoenix 1792294)  SOKET  [SOKET]
X7  0309-1065**USB Type-B Mini Connector Vertical  USB_B(YATIK)  [USB_B(YATIK)]
Y1  1149-0013**CRYSTAL 16Mhz 10pF ±10ppm 120Ohm 4-SMD 2x1.6mm -40°C ~ 85°C  NX2016SA-32M  [NX2016SA-32M]
Z1  1129-1145**ZENER SOT23 0.3W 15V BZX84C15  ZENER-DIODESOT23  [SOT23]
Z2  1129-1152**ZENER SOT23 10V 0.4W BZX84-C10  ZENER-DIODESOT23  [SOT23]
Z3  1129-1150**ZENER SOT23 6V2 225mW BZX84C6V2 (AbC)  ZENER-DIODESOT23  [SOT23]
Z4  1129-1162**ZENER SOT23 3V9 300mW BZX84C3V9  ZENER-DIODESOT23  [SOT23]
Z5  1129-1194**ZENER SOT23 30V 225mW BZX84C30V  ZENER-DIODESOT23  [SOT23]
Z8  1129-1160**ZENER SOT23 12V 300mW BZX84C12V (AbC)  ZENER-DIODESOT23  [SOT23]
Z9  1129-1140**ZENER SOT23 5V1 0.4W BZX84C5V1  ZENER-DIODESOT23  [SOT23]

## Nets
5.CANL: IC1.5(5.CANL) L3.1
30V: C24.P$2 C41.+ C45.+ C48.+ C58.+ C59.1 C61.1 C62.2 C65.1 C108.2 C111.1 L6.1 OC2.1 R52.1 R107.1 R113.2 R148.1 R193.2 TRF2.11 TRF2.12 U4.5(VIN)
+3V3: C76.1 C77.1 C79.1 C81.1 C82.1 C88.1 C89.1 C109.1 C113.1 D21.2(C) FB1.1 IC5.8(P:V+) IC9.3(OUT) LED1.2 PROG1.1(+3V3) R57.2 R66.2 R84.1 R86.2 R131.2 R135.2 U5.24(VDD.) U5.36(VDDIO2) U5.48(VDD)
+5V/1: C46.2 C134.1 IC1.8(8.VCC2) R74.2 U13.2(2.VOUT)
+12V: C50.2 C54.2 C55.2 C56.2 C64.P$1 C70.+ C94.1 C98.2 C99.1 D14.C D16.3(C) IC2.1(1.VCC) IC3.1(1.VCC) IC7.8(P:V+) IC9.2(IN) IC9.4(IN) L5.1 L8.1 OC1.1 R45.1 R78.2 R102.1 R125.2 R128.2 RL1.1 ; supply symbol labelled +5V
BLK: C29.2 R13.1 R36.1 R37.2 R38.2 U3.4(BLK)
BOOST_INP: C83.1 R105.1 U5.25(PB12)
BW: R2.2 R3.2 U3.8(BW)
CANHI: D3.1(A1) JP2.1 L3.3 R72.2 R74.1 X2.3
CANL: D3.2(A2) L3.4 R72.1 R75.1 R76.2 X2.2
CANRX: IC1.3(3.RXD) R57.1 U5.45(PB8)
CANTX: IC1.2(2.TXD) U5.46(PB9)
CUT_OFF_OUTPUT_: C103.1 D18.A R135.1 U5.12(PA2)
GATE1: IC8.GATE(G4) Q14.3(C) R128.1 R146.2 Z9.3(C)
GND: C7.1 C9.1 C10.1 C11.1 C12.2 C13.2 C14.2 C15.2 C16.2 C17.2 C18.2 C19.2 C21.1 C22.2 C23.2 C24.P$1 C25.2 C26.- C27.2 C29.1 C32.2 C33.2 C37.2 C38.- H3.3 H3.4 OC1.3 OC2.3 Q1.2(E) Q2.S Q4.3(S) R3.1 R7.1 R10.1 R14.1 R16.1 R18.2 R20.2 R22.2 R31.2 R37.1 R38.1 R49.2 T2.2(S) T6.2(S) TRF2.6 U1.1(GND) U3.11(GND) Z1.1(A)
GND3: C30.2 C31.2 C46.1 C52.2 C64.P$2 C134.2 D3.3(C) IC1.7(7.GND2) L8.8 R76.1 R77.2 U13.1(1.GND)
GNDA: C8.2 C40.1 C41.- C42.2 C44.1 C45.- C47.2 C48.- C49.2 C50.1 C54.1 C55.1 C56.1 C57.1 C58.- C59.2 C60.2 C61.2 C62.1 C63.2 C65.2 C66.- C66_X.- C67.2 C68.2 C69.2 C70.- C76.2 C77.2 C78.1 C79.2 C80.1 C81.2 C82.2 C83.2 C88.2 C89.2 C90.2 C91.1 C92.1 C93.2 C94.2 C98.1 C99.2 C100.1 C101.2 C102.2 C107.1 C108.1 C109.2 C113.2 D8.A D19.A1 D21.1(A) IC1.4(4.GND1) IC2.7(7.GND) IC3.7(7.GND) IC5.4(P:V-) IC6.A IC7.4(P:V-) IC9.1(GND) IC10.S1(S123) IC10.S2(S123) IC10.S(S123) IC11.S1(S123) IC11.S2(S123) IC11.S(S123) L4.1(1.GND) L4.4(4.GND) PROG1.3(GND) Q9.2(E) R39.2 R40.2 R53.2 R55.2 R56.2 R59.2 R61.1 R62.2 R63.2 R64.2 R67.2 R68.2 R69.2 R70.2 R80.2 R81.2 R82.2 R87.1 R94.1 R96.1 R98.1 R101.1 R108.1 R116.1 R117.2 R123.1 R127.1 R138.1 T4.2(S) TVS1.A U4.2(GND) U5.8(VSSA) U5.23(VSS..) U5.35(VSS) U5.47(VSS.) X5.3 X7.GND X7.SHLD1 X7.SHLD2 Y1.2(2.GND) Y1.4(4.GND_1) Z4.1(A)
GNDIO: D20.C IC8.D1(D5678) IC8.D2(D5678) IC8.D3(D5678) IC8.D(D5678) IC8.P$1(D5678) IC8.P$2(D5678) IC8.P$3(D5678) R58.1 T5.E X5.4
HO: Q3.1(G) R47.2
HS: C35.1 L2.1 L2.2(P1) L2.3(P1) L2.4(P1) L2.5(P1) Q3.3(S) Q4.2(D) U3.16(HS)
I_FOR_REV_BAT_PROTEC: C84.2 IC5.3(A:+IN) IC5.7(B:OUT) R104.2 R132.2
I_OUT_ADC_: C92.2 R118.2 U5.18(PB0)
I_PWM_: R89.2 U5.21(PB10)
ISNS: C25.1 C34.2 R31.1 U3.6(ISNS)
JTDO: PROG1.6(PRG_SWO) U5.39(PB3)
LED_B: R73.1 U5.38(PA15)
LED_G: R79.1 U5.43(PB7)
LED_R: R71.1 U5.40(PB4)
LLC_VAC_IN1: B1.AC1 C4.2 C5.1 D6.2(A) L1.3
LLC_VAC_IN2: B1.AC2 C4.1 C6.1 D7.2(A) L1.4
LO: Q4.1(G) R46.2
N$2: R4.2 T1.1(B) Z1.3(C)
N$3: R1.2 R2.1
N$4: C103.2 IC4.6(GND) IC8.S1(S123) IC8.S2(S123) IC8.S(S123) Q14.2(E) R98.2 R99.2 R100.2 R115.1 R142.2 R146.1 Z8.1(A) Z9.1(A)
N$5: C53.1 L8.4 T4.1(D)
N$6: R95.1 R96.2
N$7: F1.1 X1.2
N$8: R24.1 Z3.1(A)
N$11: L4.6 R129.1
N$12: C85.2 C86.2 IC4.7(OUT) R106.1
N$13: LED1.1 R71.2
N$14: R105.2 R107.2 R109.2 Z4.3(C)
N$15: C78.2 R91.2 R93.2
N$16: R32.1 U3.1(HV)
N$17: R5.2 R6.1
N$18: C35.2 D10.C U3.14(HB)
N$19: IC4.3(CC+) R93.1 R95.2
N$20: R88.2 R89.1 T3.B
N$21: Q10.3(C) R113.1 R114.2
N$22: IC4.4(CV-) R110.2 R114.1 R115.2
N$23: C32.1 R48.2 R49.1 U3.9(LL/SS)
N$24: IC4.2(CC-) R99.1 R103.2
N$25: C91.2 Q10.1(B) R117.1 R119.2
N$26: D6.1(C) D7.1(C) R32.2
N$27: R123.2 Z5.1(A)
N$28: R54.2 T4.3(G)
N$29: R5.1 R51.2
N$30: C7.2 C9.2 D1.C R4.1 T1.4(C)
N$31: OC2.2 Z5.3(C)
N$32: C53.2 R68.1
N$33: D15.A R109.1
N$34: C87.2 IC5.1(A:OUT) R111.2 R118.1
N$35: C80.2 IC4.8(VCC) R102.2
N$36: C84.1 IC5.6(B:-IN) R101.2 R104.1
N$37: IC5.5(B:+IN) R100.1
N$38: C87.1 IC5.2(A:-IN) R108.2 R111.1
N$39: C51.1 IC3.6(6.CS) IC10.D1(D5678) IC10.D2(D5678) IC10.D3(D5678) IC10.D(D5678) IC10.P$1(D5678) IC10.P$2(D5678) IC10.P$3(D5678) TRF2.9 TRF2.10
N$40: C66.+ C66_X.+ C68.1 L6.2 X5.5
N$41: R19.2 U3.7(VCR)
N$42: D15.C X5.1
N$43: D18.C R141.2 R144.1 Z8.3(C)
N$44: IC6.R R126.1 R127.2
N$45: C86.1 R110.1
N$46: D9.A L8.5
N$47: L2.6(P2) L2.7(P2) L2.8(P2) L2.9(P2) L2.10(P2) TRF2.1
N$48: Q10.2(E) R116.2
N$49: R134.1 X5.2
N$50: D10.A R50.2
N$51: C23.1 OC1.4 OC2.4 R24.2 U3.5(FB)
N$52: R47.1 U3.15(HO)
N$53: R44.1 R46.1 U3.10(LO)
N$54: C33.1 C34.1 C36.1 TRF2.4
N$55: R88.1 R90.2 R92.2 T3.E
N$56: R17.2 R18.1
N$57: C14.1 R12.2 U1.3(ISNS)
N$58: R11.1 T2.1(D)
N$59: D4.A Q2.G R21.1 R22.1
N$60: R14.2 U1.4(FREQ)
N$61: C12.1 Q1.3(C) R8.1 R9.2
N$62: C30.1 C31.1 D9.C U13.3(3.VIN)
N$63: TP2.TP U5.10(PA0)
N$64: TRF2.2 TRF2.3
N$65: C1.1 C3.1 L1.2 NTC1.P$1 VR1.1
N$67: R94.2 U5.44(BOOT0)
N$68: C28.2 R20.1 T6.1(D)
N$69: R6.2 R7.2 Z2.3(C)
N$70: C16.1 R15.1
N$71: C13.1 U1.2(ICOMP)
N$72: C20.1 D5.A Q2.D R23.1 R25.1 R26.1 R30.1 U2.2
N$73: IC2.4(4.LLD) R62.1
N$74: IC2.8(8.DRV) IC3.5(5.TRIG) IC11.GATE(G4)
N$75: C20.2 R27.2 R28.2 R29.2
N$76: C21.2 R23.2 R25.2 R26.2 R30.2
N$77: IC2.2(2.MIN_TOFF) R64.1
N$78: IC3.4(4.LLD) R80.1
N$80: B1.+ D12.A R51.1 U2.1
N$83: NTC1.P$2 X1.1
N$84: C18.1 R15.2 U1.5(VCOMP)
N$85: R90.1 R91.1 T3.C
N$87: C52.1 R77.1 X2.1
N$88: D20.A R148.2 T5.B
N$89: JP2.2 R75.2
N$90: IC1.6(6.CANH) L3.2
N$92: C67.1 C69.1 R86.1 U5.9(VDDA)
N$93: C37.1 R44.2 T6.3(G)
N$94: C43.2 D8.C L5.2 U4.6(LX)
N$95: LED1.4 R73.2
N$96: LED1.3 R79.2
N$99: R144.2 T5.C
N$100: IC2.3(3.MIN_TON) R63.1
N$101: IC7.6(B:-IN) R137.1 R138.2 R145.1
N$102: D19.A IC7.5(B:+IN) R134.2 R136.1 R143.1
N$103: Q14.1(B) R132.1 R141.1 R142.1
N$104: IC7.7(B:OUT) R143.2 R145.2 R147.1
N$105: C43.1 R194.2
N$106: C39.2 R40.1 R55.1 R56.1
N$107: D14.A Q9.3(C) RL1.2
N$108: Q9.1(B) R85.1 R87.2
N$109: L4.5 R130.1
N$110: C100.2 IC6.C IC7.3(A:+IN) R125.1 R126.2
N$111: IC7.1(A:OUT) IC7.2(A:-IN) R136.2 R137.2
N$112: C39.1 IC2.6(6.CS) IC11.D1(D5678) IC11.D2(D5678) IC11.D3(D5678) IC11.D(D5678) IC11.P$1(D5678) IC11.P$2(D5678) IC11.P$3(D5678) TRF2.7 TRF2.8
N$113: R34.1 R35.2
N$114: R33.1 R34.2
N$115: R9.1 R10.2 T2.3(G)
N$116: R194.1 U4.1(BS)
N$117: Q1.1(B) Z2.1(A)
N$118: B1.- R12.1 R17.1
N$119: IC2.5(5.TRIG) IC3.8(8.DRV) IC10.GATE(G4)
N$120: R193.1 U4.4(EN)
N$121: IC3.2(2.MIN_TOFF) R82.1
N$122: IC3.3(3.MIN_TON) R81.1
N$124: C51.2 R39.1 R69.1 R70.1
N$155: R65.2 R78.1
N$156: L4.3 X7.D-
N$157: L4.2 X7.D+
N$161: C93.1 D16.1(A1) D16.2(A2) R120.1 TVS1.C
N$210: C40.2 C44.2 FB1.2 IC1.1(1.VCC1)
N$254: C85.1 R103.1
NEUTRAL: C2.1 C3.2 F1.2 L1.1 VR1.2
NRST: C57.2 PROG1.5(NRST) R84.2 U5.7(NRST)
OSC1: C60.1 U5.5(PF0/OSC_IN) Y1.3
OSC2: C63.1 U5.6(PF1/OSC_OUT) Y1.1
PE: C1.2 C2.2 C5.2 C6.2 C90.1 C111.2 X1.3 ; supply symbol labelled EARTH
PT100_ADC: C107.2 D21.3(AC) R147.2 U5.11(PA1)
PWM_CAN: R54.1 U5.28(PB15)
Q1_GATE: D4.C R21.2 U1.8(GATE)
RELAY_OP: R85.2 U5.17(PA7)
RL+: RL1.P0 RL1.P1 X5.7
RL-: RL1.S0 X5.6
RVCC_12V: C15.1 C17.1 R8.2 R48.1 R50.1 U1.7(VCC) U3.12(RVCC) Z3.3(C)
SWCLK: PROG1.2(PRG_SWCLK) U5.37(PA14)
SWDIO: PROG1.4(PRG_SWDIO) U5.34(PA13)
U3-K: OC1.2 R45.2 R106.2
USB_DM: C101.1 R130.2 U5.32(PA11)
USB_DP: C102.1 R129.2 R131.1 U5.33(PA12)
V_FB2: C49.1 R61.2 R65.1 U4.3(FB)
V_NTC_ADC: C47.1 R66.1 R67.1 U5.19(PB1)
V_PWM_: R119.1 U5.13(PA3)
VAC_AUX: D1.A R1.1 TRF2.5
VBAT_ADC: C42.1 R58.2 R59.1 U5.16(PA6)
VBUS1: R120.2 X7.VBUS
VCC: C26.+ C27.1 D2.C U3.3(VCC)
VCR: C28.1 C36.2 R19.1
VDC_AUX: C10.2 C11.2 D2.A T1.3(E)
VOUT: C22.1 C38.+ D5.K(C) D12.C Q3.2(D) R27.1 R28.1 R29.1 R33.2
VOUT+_ADC: C8.1 R52.2 R53.1 U5.15(PA5)
VREF2.1: IC4.1(VREF) IC4.5(CV+) R92.1
VSENSE: C19.1 R11.2 R13.2 R16.2 R35.1 R36.2 U1.6(VSNS)
Unconnected: H3.1 H3.2 U5.1(VBAT) U5.2(PC13) U5.3(PC14/OSC32_IN) U5.4(PC15/OSC32_OUT) U5.14(PA4) U5.20(PB2) U5.22(PB11) U5.26(PB13) U5.27(PB14) U5.29(PA8) U5.30(PA9) U5.31(PA10) U5.41(PB5) U5.42(PB6)

## Notes on the sheet
- DEĞİŞİKLİK YAPILDI!!!
- CANBUS
- ISOLATED CANBUS1
- 1kV ISOLATION
- 1kV ISOLATION
- ADC INPUTS | PROGRAMMER | RELAY | BOOST INPUT | REGULATORS
- BOOST 
  INPUT
- MICROCONTROLLER
- AUX SUPPLY | LLC CONT.
- USB
- USB
- CANBUS | MCU
- PLANE KULLNILIRSA 
  IZOLASYONA DIKKAT
- Eski versiyonla aradaki farklar
  
  silinen komponentler;
       R19,R97
       C8,C62 
       D3,D12 
  değiştirilen komponentler;
       C3,C4
       U4
       TRF1
       IC5 MCP602I ile değiştirildi
       R17
- 6n8
- EXTERNAL NTC
- PRIMER
- CS400060
- LLC STAGE
- FİZİKSEL PAKETE GÖRE YENİDEN
   KÜTÜPHANE OLUŞTURULACAK
- 38*25mm olacak
- ve E36/18/11 için alternatğf pad
   ilave edilecek
- E30/15/7
- E42/21/15
- SECONDER
- FİZİKSEL PAKETE GÖRE YENİDEN
   KÜTÜPHANE OLUŞTURULACAK
- FİZİKSEL PAKETE GÖRE YENİDEN
   KÜTÜPHANE OLUŞTURULACAK
- Over voltage protection | Rev. Bat. Protection
- Q12 base ile Q14 base bağlanıp Q12 NC olabilir
- AUXILIARY VOLTAGE REGULATOR
- STM32G030F6P6
- ISOLATION BARRIER
- ISOLATED CONVERTER

## Library data of the parts
B1 = ENKO2:DıODE_BRIDGE_8A_DIK
C1 C2 C5-C23 C25 C27-C37 C39 C40 C42-C44 C46 C47 C49-C57 C59-C63 C65 C67-C69 C76-C94 C98-C103 C107-C109 C111 C113 C134 = rcl:C-EU: CAPACITOR, European symbol
C3 C4 = ENKO2:C275-134X316
C24 C64 = ENKO2:C075-32X103_DEIF
C26 C38 C41 C45 C48 C58 C66 C66_X C70 = rcl:CPOL-EU: POLARIZED CAPACITOR, European symbol
D1 D2 D4 D9 D10 D14 D15 D18 D20 = diode:DIODE-: DIODE
D3 = diode:DIODE-2CAPACITANCE: Capacity DIODE variable-capacitance diode (Infineon)
D5 = enko:DIODE_12A_1000V_TO220
D6 D7 = ENKO2:DIODE: Diode Rectifier - Generic; CATEGORY: Diode; SUB-CATEGORY: Rectifier; VALUE: DIODE
D8 = diodes:SD-: Schottky diode
D12 = diode:SCHOTTKY-DIODE: Schottky Diode
D16 = diode:DIODE-2AC|CA: Dual DIODE Anode-Cathode|Cathode-Anode
D19 = diode:TRANSIL_SMB
D21 = diode:BAV199: DIODE low-leakage double diode
F1 = fuse:19560: FUSE HOLDER TR5, Wickmann; MPN: 56000001009; OC_FARNELL: 1185363; OC_NEWARK: 15P8392
FB1 = ENKO2:FERRITE_BEAT_0805
H3 = ENKO2:DEIF_SOGUTUCU_300W
IC1 = enko:ISO1044
IC2 IC3 = enko:NCP4306
IC4 = mutlu:TSM1011
IC5 = linear:LMV358?*: Dual General Purpose, Low Voltage, Rail-to-Rail Output Operational Amplifiers Source: http://www.national.com/mpf/LM/LMV321.html http://www.national.com/dt/lmv_qual.pdf
IC6 = enko:TL431_SOT23F
IC7 = linear:LM358: OP AMP also LM158; LM258; LM2904 Source: http://cache.national.com/ds/LM/LM158.pdf
IC8 IC10 IC11 = enko:TPH6R30ANL
IC9 = v-reg-3:S-812XSG: Low power, low dropout positive regulator
JP2 = jumper:JP1E: JUMPER
JP2-K X1-K X2-K X5-K = BOM:SOKET
L1 = enko:EPCOS_B82724J
L2 = ENKO2:E25/13/7
L3 = enko:ACM2012-900--2P-T002
L4 = enko:EXC24CS_COMMON_MODE
L5 = wuerth-elektronik:WE-PD2: SMD-Power Inductors WE-PD2 Is recommended for the application with switching regulators from National Semiconductor, Linear Technology, Texas Instruments and Fairchild Semiconductor -- Switching regulators with low operating voltages (computer, laptop, mobile phones, pagers) -- Integrated DC/DC-converter
L6 = enko:INDUCTOR-NEOSID
L8 = enko:EE10_V_4+4
LED1 = ENKO2:KPFA-3010RGBC-11
NTC1 = enko:SENS_NTC
OC1 OC2 = enko:PS2561DL2-1_OPTO1
PCB STENCIL = BOM:PCB
PROG1 = ENKO2:PROG_6PIN
Q1 Q9 Q10 Q14 = transistor-npn:BC846*: NPN Transistor
Q2 = transistor-power:PMOSFET_N: Power MOSFET N-Channel
Q3 Q4 = enko:ISO_TO_220
R1-R40 R44-R59 R61-R82 R84-R96 R98-R111 R113-R120 R123 R125-R132 R134-R138 R141-R148 R193 R194 = rcl:R-EU_: RESISTOR, European symbol
RL1 = enko:ALD1_AND_ALJ_RELAY
T1 = ENKO2:MJD31*: Complementary Power Transistors
T2 T4 T6 = zetex:NMOSSOT23: MOS FET; OC_FARNELL: unknown; OC_NEWARK: unknown
T3 T5 = transistor:*-PNP-: PNP Transistror
TP2 = testpad:PTR1: TEST PIN
TRF2 = ENKO2:E34/14/9
TVS1 = supressor:TVS-BD-: TVS BI-DIRECTIONAL
U1 = ENKO2:UCC28180
U2 = mutlu:IND_TOROID
U3 = ENKO2:UCC256301
U4 = enko:AOZ1282CI-1
U5 = enko:STM32F072CXXX_LQFP48
U13 = enko:AP2210N-5.0TRG1_SOT23-3
VR1 = varistor:S20K40: VARISTOR
X1 = con-phoenix-762:GMSTBA3: PHOENIX; MF: FARNELL; MPN: 1757255; OC_FARNELL: 3705183; OC_NEWARK: 71C4162
X2 = con-phoenix-508:MSTBA3: PHOENIX; MF: FARNELL; MPN: 1757255; OC_FARNELL: 3705183; OC_NEWARK: 71C4162
X5 = con-phoenix-508:MSTBA7: PHOENIX; OC_FARNELL: unknown; OC_NEWARK: unknown
X7 = ENKO2:USB_B(YATIK)
Y1 = enko:NX2016SA-32M
Z1-Z5 Z8 Z9 = diode:ZENER-DIODE: Z-Diode